# EAGLE schematic ABK-ECS - Rev B1 (EAGLE 7.7.0)

## Sheet 1 of 8: MCU
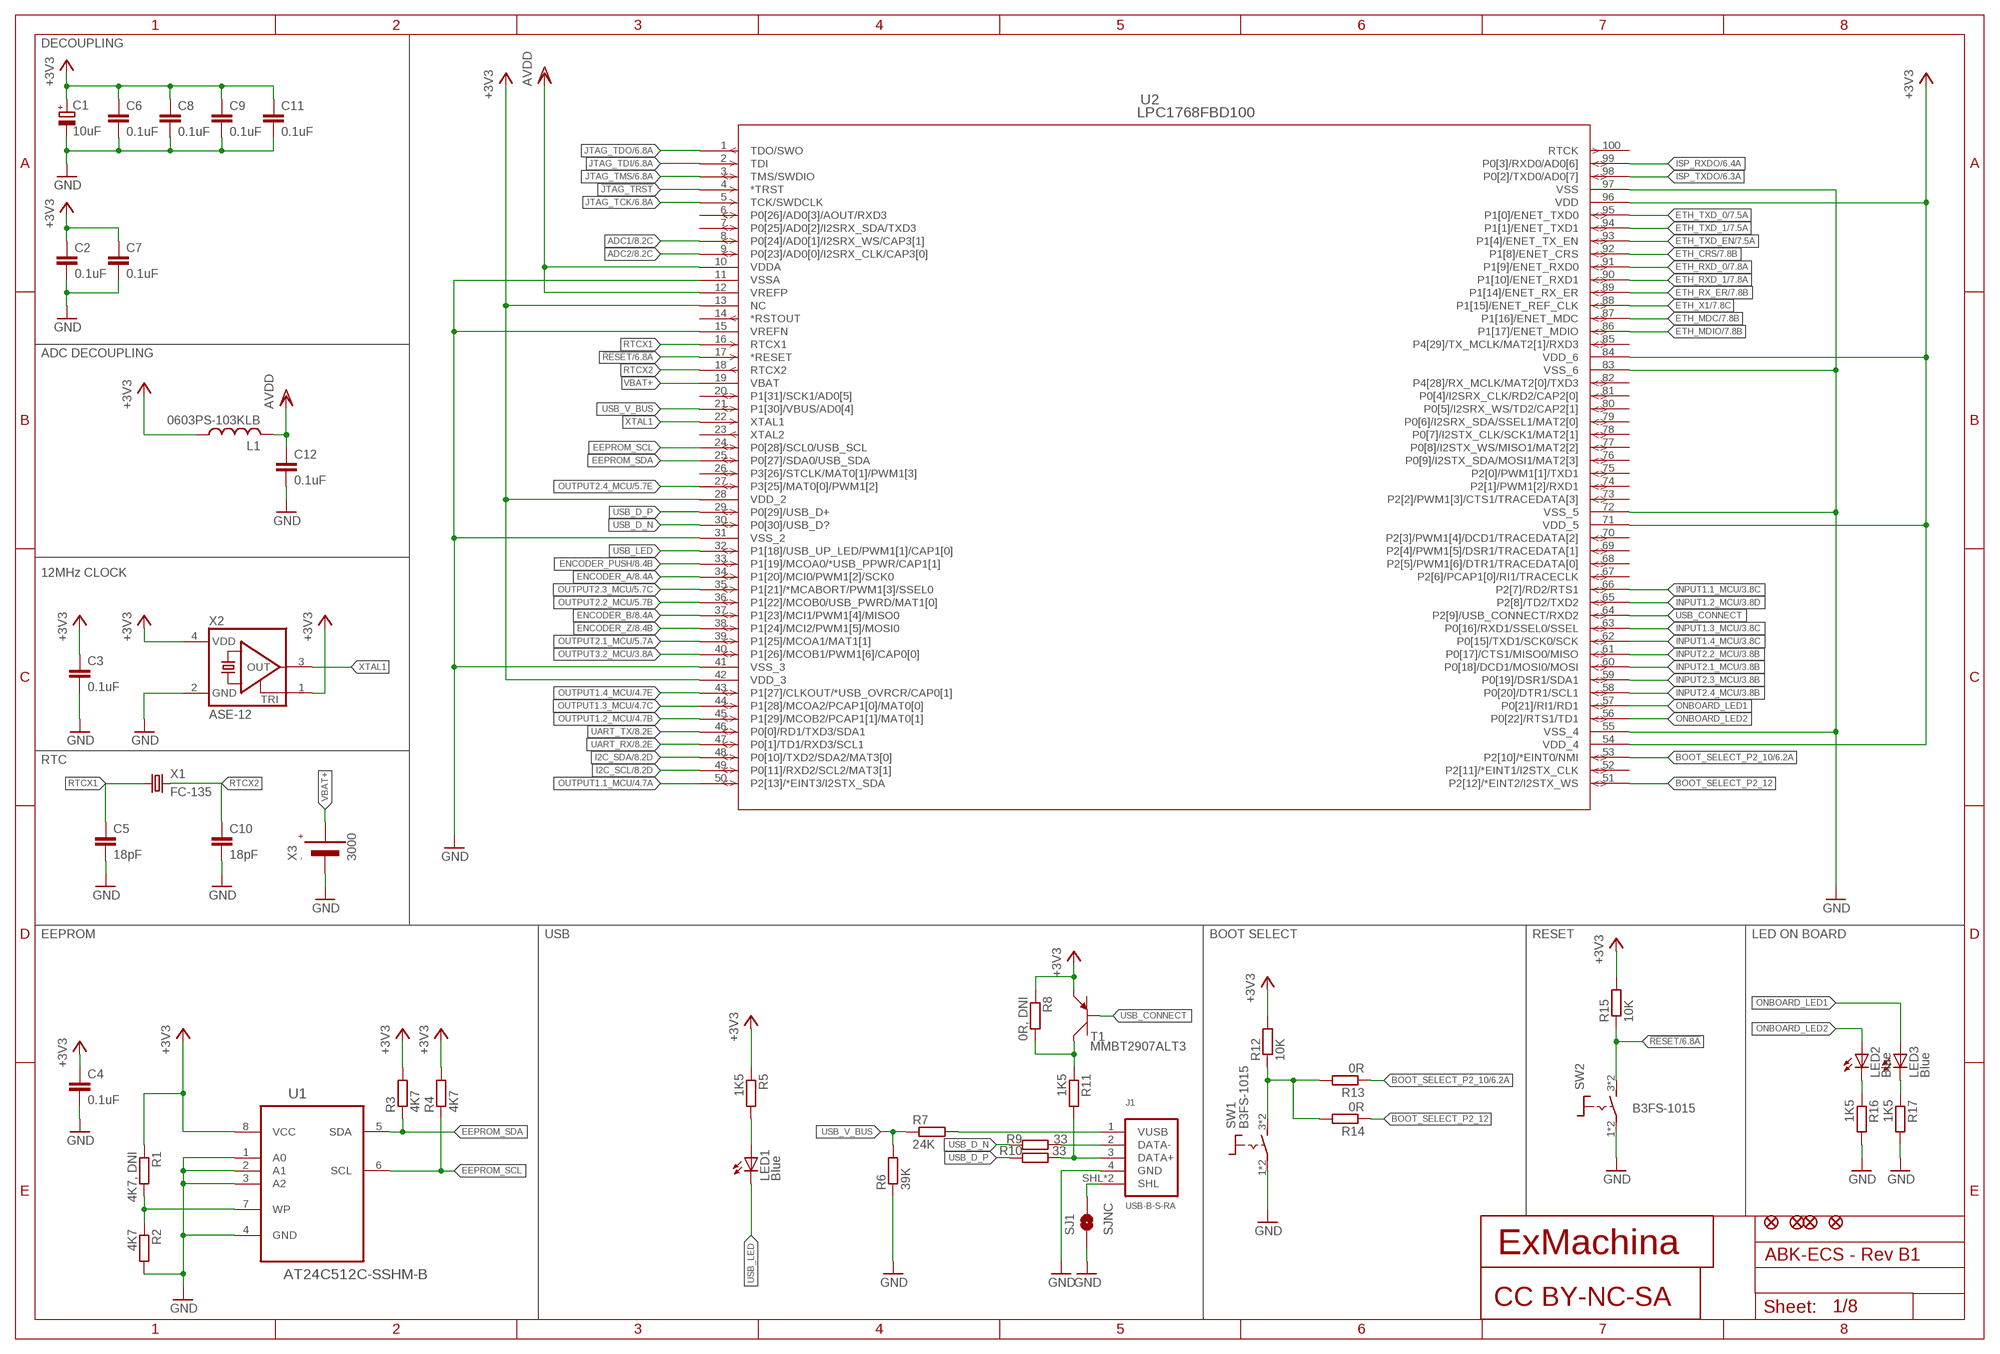
[diagram p0: schematic, sheet 1]

### Parts
C1  10uF  CPOL-EUCT3216  [CT3216]
C2  0.1uF  C-EUC0603  [C0603]
C3  0.1uF  C-EUC0603  [C0603]
C4  0.1uF  C-EUC0603  [C0603]
C5  18pF  C-EUC0603  [C0603]
C6  0.1uF  C-EUC0603  [C0603]
C7  0.1uF  C-EUC0603  [C0603]
C8  0.1uF  C-EUC0603  [C0603]
C9  0.1uF  C-EUC0603  [C0603]
C10  18pF  C-EUC0603  [C0603]
C11  0.1uF  C-EUC0603  [C0603]
C12  0.1uF  C-EUC0603  [C0603]
CC1  CC-BY-NC-SA  [CC-BY-NC-SA]
J1  USB-B-S-RA  [USB-B-S-RA]
JP1  FIDUCIAL1X2  [FIDUCIAL-1X2]
JP2  FIDUCIAL1X2  [FIDUCIAL-1X2]
JP3  FIDUCIAL1X2  [FIDUCIAL-1X2]
JP4  FIDUCIAL1X2  [FIDUCIAL-1X2]
L1  0603PS-103KLB  0603PS  [0603]
LED1  Blue  LEDCHIPLED_0603  [CHIPLED_0603]
LED2  Blue  LEDCHIPLED_0603  [CHIPLED_0603]
LED3  Blue  LEDCHIPLED_0603  [CHIPLED_0603]
R1  4K7, DNI  R-EU_R0603  [R0603]
R2  4K7  R-EU_R0603  [R0603]
R3  4K7  R-EU_R0603  [R0603]
R4  4K7  R-EU_R0603  [R0603]
R5  1K5  R-EU_R0603  [R0603]
R6  39K  R-EU_R0603  [R0603]
R7  24K  R-EU_R0603  [R0603]
R8  0R, DNI  R-EU_R0603  [R0603]
R9  33  R-EU_R0603  [R0603]
R10  33  R-EU_R0603  [R0603]
R11  1K5  R-EU_R0603  [R0603]
R12  10K  R-EU_R0603  [R0603]
R13  0R  R-EU_R0603  [R0603]
R14  0R  R-EU_R0603  [R0603]
R15  10K  R-EU_R0603  [R0603]
R16  1K5  R-EU_R0603  [R0603]
R17  1K5  R-EU_R0603  [R0603]
SJ1  SJNC  [SJ_2S]
SW1  B3FS-1015  [B3FS]
SW2  B3FS-1015  [B3FS]
T1  MMBT2907ALT3  [SOT−23]
T2  EXMACHINA-LOGO-NAME  [EXM-LOGO-BASELINE]
U1  AT24C512C-SSHM-B  [SOIC127P600X175-8N]
U2  LPC1768FBD100  [SOT407-1]
X1  FC-135  [FC-135]
X2  ASE-12  ASE  [ASE]
X3  3000  [3000]

### Nets
!JTAG_TRST: U2.4(*TRST)
!RESET: R15.1 SW2.3 SW2.4 U2.17(*RESET) ; also sheet 6
+3V3 [supply]: C1.+ C2.1 C3.1 C4.1 C6.1 C7.1 C8.1 C9.1 C11.1 L1.P$1 R1.1 R3.2 R4.2 R5.1 R8.1 R12.2 R15.2 T1.3(C) U1.8(VCC) U2.13(NC) U2.28(VDD_2) U2.42(VDD_3) U2.54(VDD_4) U2.71(VDD_5) U2.84(VDD_6) U2.96(VDD) X2.1(TRI) X2.4(VDD) ; also sheet 2,3,6,7,8
ADC1: U2.8(P0[24]/AD0[1]/I2SRX_WS/CAP3[1]) ; also sheet 8
ADC2: U2.9(P0[23]/AD0[0]/I2SRX_CLK/CAP3[0]) ; also sheet 8
AVDD: C12.1 L1.P$2 U2.10(VDDA) U2.12(VREFP) ; also sheet 8
BOOT_SELECT_P2_10 [signal]: R13.1 U2.53(P2[10]/*EINT0/NMI) ; also sheet 6
BOOT_SELECT_P2_12 [signal]: R14.1 U2.51(P2[12]/*EINT2/I2STX_WS)
EEPROM_SCL: R4.1 U1.6(SCL) U2.24(P0[28]/SCL0/USB_SCL)
EEPROM_SDA: R3.1 U1.5(SDA) U2.25(P0[27]/SDA0/USB_SDA)
ENCODER_A: U2.34(P1[20]/MCI0/PWM1[2]/SCK0) ; also sheet 8
ENCODER_B: U2.37(P1[23]/MCI1/PWM1[4]/MISO0) ; also sheet 8
ENCODER_PUSH: U2.33(P1[19]/MCOA0/*USB_PPWR/CAP1[1]) ; also sheet 8
ENCODER_Z: U2.38(P1[24]/MCI2/PWM1[5]/MOSI0) ; also sheet 8
ETH_CRS [signal]: U2.92(P1[8]/ENET_CRS) ; also sheet 7
ETH_MDC [signal]: U2.87(P1[16]/ENET_MDC) ; also sheet 7
ETH_MDIO [signal]: U2.86(P1[17]/ENET_MDIO) ; also sheet 7
ETH_RX_ER [signal]: U2.89(P1[14]/ENET_RX_ER) ; also sheet 7
ETH_RXD_0 [signal]: U2.91(P1[9]/ENET_RXD0) ; also sheet 7
ETH_RXD_1 [signal]: U2.90(P1[10]/ENET_RXD1) ; also sheet 7
ETH_TXD_0 [signal]: U2.95(P1[0]/ENET_TXD0) ; also sheet 7
ETH_TXD_1 [signal]: U2.94(P1[1]/ENET_TXD1) ; also sheet 7
ETH_TXD_EN [signal]: U2.93(P1[4]/ENET_TX_EN) ; also sheet 7
ETH_X1 [signal]: U2.88(P1[15]/ENET_REF_CLK) ; also sheet 7
GND [supply]: C1.- C2.2 C3.2 C4.2 C5.2 C6.2 C7.2 C8.2 C9.2 C10.2 C11.2 C12.2 J1.4(GND) R2.2 R6.1 R16.2 R17.2 SJ1.1 SW1.1 SW1.2 SW2.1 SW2.2 U1.1(A0) U1.2(A1) U1.3(A2) U1.4(GND) U2.11(VSSA) U2.15(VREFN) U2.31(VSS_2) U2.41(VSS_3) U2.55(VSS_4) U2.72(VSS_5) U2.83(VSS_6) U2.97(VSS) X2.2(GND) X3.-(VBAT-) ; also sheet 2,3,4,5,6,7,8
I2C_SCL: U2.49(P0[11]/RXD2/SCL2/MAT3[1]) ; also sheet 8
I2C_SDA: U2.48(P0[10]/TXD2/SDA2/MAT3[0]) ; also sheet 8
INPUT1.1_MCU: U2.66(P2[7]/RD2/RTS1) ; also sheet 3
INPUT1.2_MCU: U2.65(P2[8]/TD2/TXD2) ; also sheet 3
INPUT1.3_MCU: U2.63(P0[16]/RXD1/SSEL0/SSEL) ; also sheet 3
INPUT1.4_MCU: U2.62(P0[15]/TXD1/SCK0/SCK) ; also sheet 3
INPUT2.1_MCU: U2.60(P0[18]/DCD1/MOSI0/MOSI) ; also sheet 3
INPUT2.2_MCU: U2.61(P0[17]/CTS1/MISO0/MISO) ; also sheet 3
INPUT2.3_MCU: U2.59(P0[19]/DSR1/SDA1) ; also sheet 3
INPUT2.4_MCU: U2.58(P0[20]/DTR1/SCL1) ; also sheet 3
ISP_RXDO [signal]: U2.99(P0[3]/RXD0/AD0[6]) ; also sheet 6
ISP_TXDO [signal]: U2.98(P0[2]/TXD0/AD0[7]) ; also sheet 6
JTAG_TCK [signal]: U2.5(TCK/SWDCLK) ; also sheet 6
JTAG_TDI [signal]: U2.2(TDI) ; also sheet 6
JTAG_TDO [signal]: U2.1(TDO/SWO) ; also sheet 6
JTAG_TMS [signal]: U2.3(TMS/SWDIO) ; also sheet 6
N$1 [signal]: J1.3(DATA+) R10.1 R11.2
N$2 [signal]: J1.2(DATA-) R9.1
N$3 [signal]: LED3.C R17.1
N$5 [signal]: R12.1 R13.2 R14.2 SW1.3 SW1.4
N$27: R1.2 R2.1 U1.7(WP)
N$28: LED1.A R5.2
N$29 [signal]: LED2.C R16.1
N$30: R8.2 R11.1 T1.2(E)
N$70: J1.SHL J1.SHL1(SHL) SJ1.2
N$114: J1.1(VUSB) R7.2
ONBOARD_LED1 [signal]: LED3.A U2.57(P0[21]/RI1/RD1)
ONBOARD_LED2 [signal]: LED2.A U2.56(P0[22]/RTS1/TD1)
OUTPUT1.1_MCU: U2.50(P2[13]/*EINT3/I2STX_SDA) ; also sheet 4
OUTPUT1.2_MCU: U2.45(P1[29]/MCOB2/PCAP1[1]/MAT0[1]) ; also sheet 4
OUTPUT1.3_MCU: U2.44(P1[28]/MCOA2/PCAP1[0]/MAT0[0]) ; also sheet 4
OUTPUT1.4_MCU: U2.43(P1[27]/CLKOUT/*USB_OVRCR/CAP0[1]) ; also sheet 4
OUTPUT2.1_MCU: U2.39(P1[25]/MCOA1/MAT1[1]) ; also sheet 5
OUTPUT2.2_MCU: U2.36(P1[22]/MCOB0/USB_PWRD/MAT1[0]) ; also sheet 5
OUTPUT2.3_MCU: U2.35(P1[21]/*MCABORT/PWM1[3]/SSEL0) ; also sheet 5
OUTPUT2.4_MCU: U2.27(P3[25]/MAT0[0]/PWM1[2]) ; also sheet 5
OUTPUT3.2_MCU: U2.40(P1[26]/MCOB1/PWM1[6]/CAP0[0]) ; also sheet 3,5
RTCX1: C5.1 U2.16(RTCX1) X1.1
RTCX2: C10.1 U2.18(RTCX2) X1.2
UART_RX: U2.47(P0[1]/TD1/RXD3/SCL1) ; also sheet 8
UART_TX: U2.46(P0[0]/RD1/TXD3/SDA1) ; also sheet 8
USB_CONNECT: T1.1(B) U2.64(P2[9]/USB_CONNECT/RXD2)
USB_D_N [signal]: R9.2 U2.30(P0[30]/USB_D?)
USB_D_P [signal]: R10.2 U2.29(P0[29]/USB_D+)
USB_LED: LED1.C U2.32(P1[18]/USB_UP_LED/PWM1[1]/CAP1[0])
USB_V_BUS [signal]: R6.2 R7.1 U2.21(P1[30]/VBUS/AD0[4])
VBAT+: U2.19(VBAT) X3.+1(VBAT+) X3.+2(VBAT+)
XTAL1: U2.22(XTAL1) X2.3(OUT)
Unconnected: U2.6(P0[26]/AD0[3]/AOUT/RXD3) U2.7(P0[25]/AD0[2]/I2SRX_SDA/TXD3) U2.14(*RSTOUT) U2.20(P1[31]/SCK1/AD0[5]) U2.23(XTAL2) U2.26(P3[26]/STCLK/MAT0[1]/PWM1[3]) U2.52(P2[11]/*EINT1/I2STX_CLK) U2.67(P2[6]/PCAP1[0]/RI1/TRACECLK) U2.68(P2[5]/PWM1[6]/DTR1/TRACEDATA[0]) U2.69(P2[4]/PWM1[5]/DSR1/TRACEDATA[1]) U2.70(P2[3]/PWM1[4]/DCD1/TRACEDATA[2]) U2.73(P2[2]/PWM1[3]/CTS1/TRACEDATA[3]) U2.74(P2[1]/PWM1[2]/RXD1) U2.75(P2[0]/PWM1[1]/TXD1) U2.76(P0[9]/I2STX_SDA/MOSI1/MAT2[3]) U2.77(P0[8]/I2STX_WS/MISO1/MAT2[2]) U2.78(P0[7]/I2STX_CLK/SCK1/MAT2[1]) U2.79(P0[6]/I2SRX_SDA/SSEL1/MAT2[0]) U2.80(P0[5]/I2SRX_WS/TD2/CAP2[1]) U2.81(P0[4]/I2SRX_CLK/RD2/CAP2[0]) U2.82(P4[28]/RX_MCLK/MAT2[0]/TXD3) U2.85(P4[29]/TX_MCLK/MAT2[1]/RXD3) U2.100(RTCK)

### Notes on the sheet
- DECOUPLING
- ADC DECOUPLING
- 12MHz CLOCK
- RTC
- EEPROM | USB | BOOT SELECT | RESET | LED ON BOARD

## Sheet 2 of 8: POWER
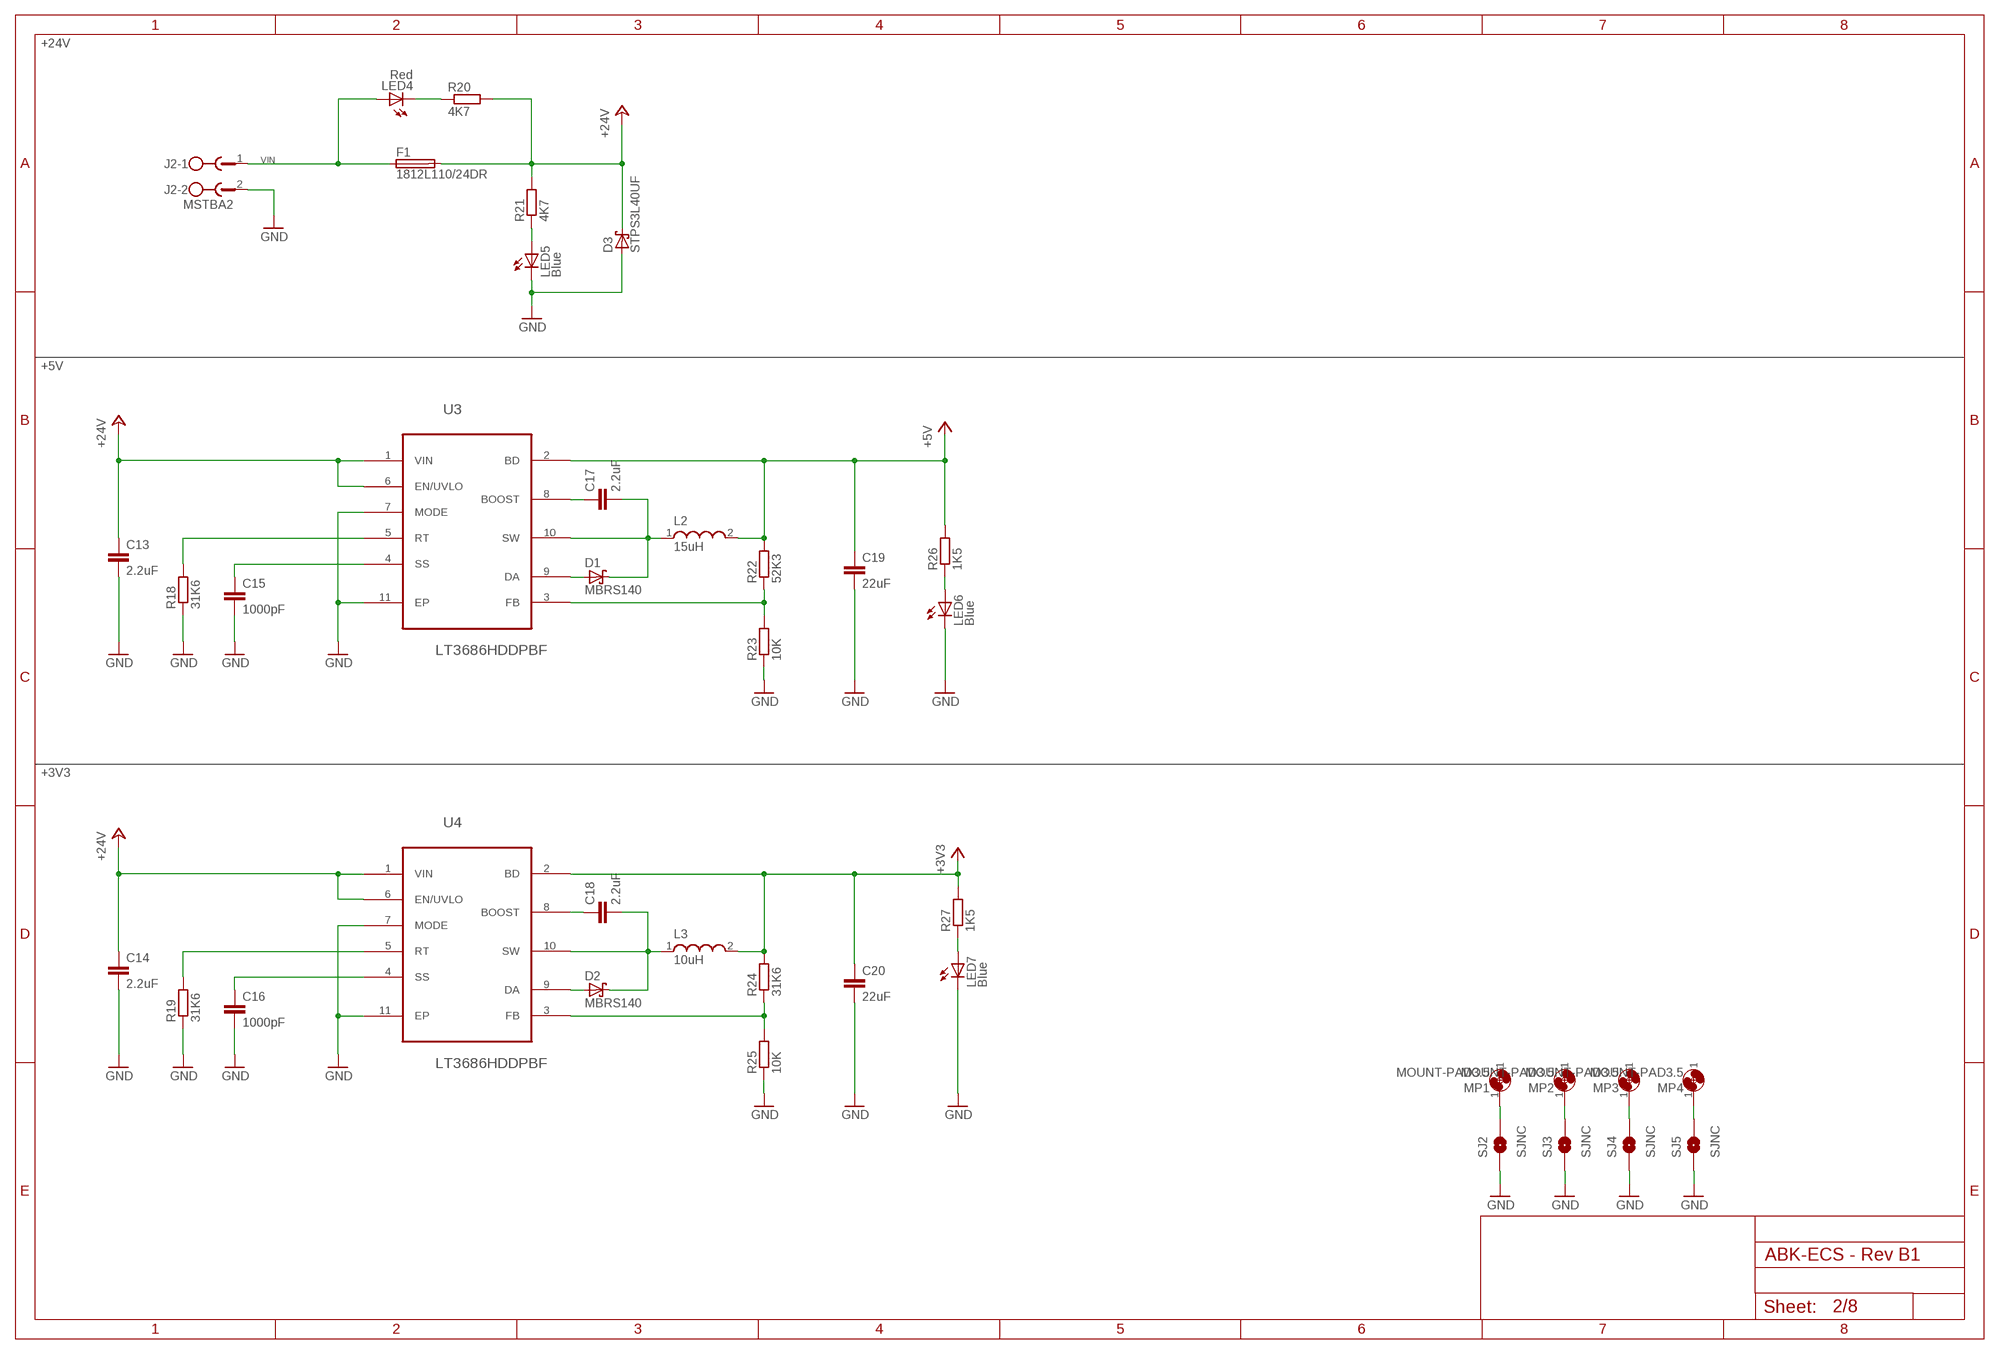
[diagram p1: schematic, sheet 2]

### Parts
C13  2.2uF  C-EUC0603  [C0603]
C14  2.2uF  C-EUC0603  [C0603]
C15  1000pF  C-EUC0603  [C0603]
C16  1000pF  C-EUC0603  [C0603]
C17  2.2uF  C-EUC0603  [C0603]
C18  2.2uF  C-EUC0603  [C0603]
C19  22uF  C-EUC0805  [C0805]
C20  22uF  C-EUC0805  [C0805]
D1  MBRS140  [DO-214AA]
D2  MBRS140  [DO-214AA]
D3  STPS3L40UF  [SMB]
F1  1812L110/24DR  [LITTLEFUSE_SMD]
J2  MSTBA2  [MSTBA2]
L2  15uH  WE-PD2_5848/5820  [WE-PD2_5848/5820]
L3  10uH  WE-PD2_5848/5820  [WE-PD2_5848/5820]
LED4  Red  LEDCHIPLED_0603  [CHIPLED_0603]
LED5  Blue  LEDCHIPLED_0603  [CHIPLED_0603]
LED6  Blue  LEDCHIPLED_0603  [CHIPLED_0603]
LED7  Blue  LEDCHIPLED_0603  [CHIPLED_0603]
MP1  MOUNT-PAD3.5  [P3,5]
MP2  MOUNT-PAD3.5  [P3,5]
MP3  MOUNT-PAD3.5  [P3,5]
MP4  MOUNT-PAD3.5  [P3,5]
R18  31K6  R-EU_R0603  [R0603]
R19  31K6  R-EU_R0603  [R0603]
R20  4K7  R-EU_R0603  [R0603]
R21  4K7  R-EU_R0603  [R0603]
R22  52K3  R-EU_R0603  [R0603]
R23  10K  R-EU_R0603  [R0603]
R24  31K6  R-EU_R0603  [R0603]
R25  10K  R-EU_R0603  [R0603]
R26  1K5  R-EU_R0603  [R0603]
R27  1K5  R-EU_R0603  [R0603]
SJ2  SJNC  [SJ_2S]
SJ3  SJNC  [SJ_2S]
SJ4  SJNC  [SJ_2S]
SJ5  SJNC  [SJ_2S]
U3  LT3686HDDPBF  [DFN300X300X80-11N]
U4  LT3686HDDPBF  [DFN300X300X80-11N]

### Nets
1: MP1.1 SJ2.2
2: MP2.1 SJ3.2
3: MP3.1 SJ4.2
4: MP4.1 SJ5.2
+3V3 [supply]: C20.1 L3.2 R24.2 R27.2 U4.2(BD) ; also sheet 1,3,6,7,8
+5V [supply]: C19.1 L2.2 R22.2 R26.2 U3.2(BD) ; also sheet 3,4,5,7,8
+24V: C13.1 C14.1 D3.C F1.2 R20.2 R21.2 U3.1(VIN) U3.6(EN/UVLO) U4.1(VIN) U4.6(EN/UVLO) ; also sheet 3,4,5
GND [supply]: C13.2 C14.2 C15.2 C16.2 C19.2 C20.2 D3.A J2.2 LED5.C LED6.C LED7.C R18.1 R19.1 R23.1 R25.1 SJ2.1 SJ3.1 SJ4.1 SJ5.1 U3.7(MODE) U3.11(EP) U4.7(MODE) U4.11(EP) ; also sheet 1,3,4,5,6,7,8
N$4: R18.2 U3.5(RT)
N$6: C15.1 U3.4(SS)
N$7: R19.2 U4.5(RT)
N$8: C16.1 U4.4(SS)
N$9: R22.1 R23.2 U3.3(FB)
N$10: C17.1 U3.8(BOOST)
N$11: C17.2 D1.C L2.1 U3.10(SW)
N$12: D1.A U3.9(DA)
N$13: R24.1 R25.2 U4.3(FB)
N$14: C18.1 U4.8(BOOST)
N$15: C18.2 D2.C L3.1 U4.10(SW)
N$16: D2.A U4.9(DA)
N$44: LED5.A R21.1
N$45: LED4.C R20.1
N$50: LED7.A R27.1
N$51: LED6.A R26.1
VIN: F1.1 J2.1 LED4.A

### Notes on the sheet
- +24V
- +5V
- +3V3

## Sheet 3 of 8: INPUT
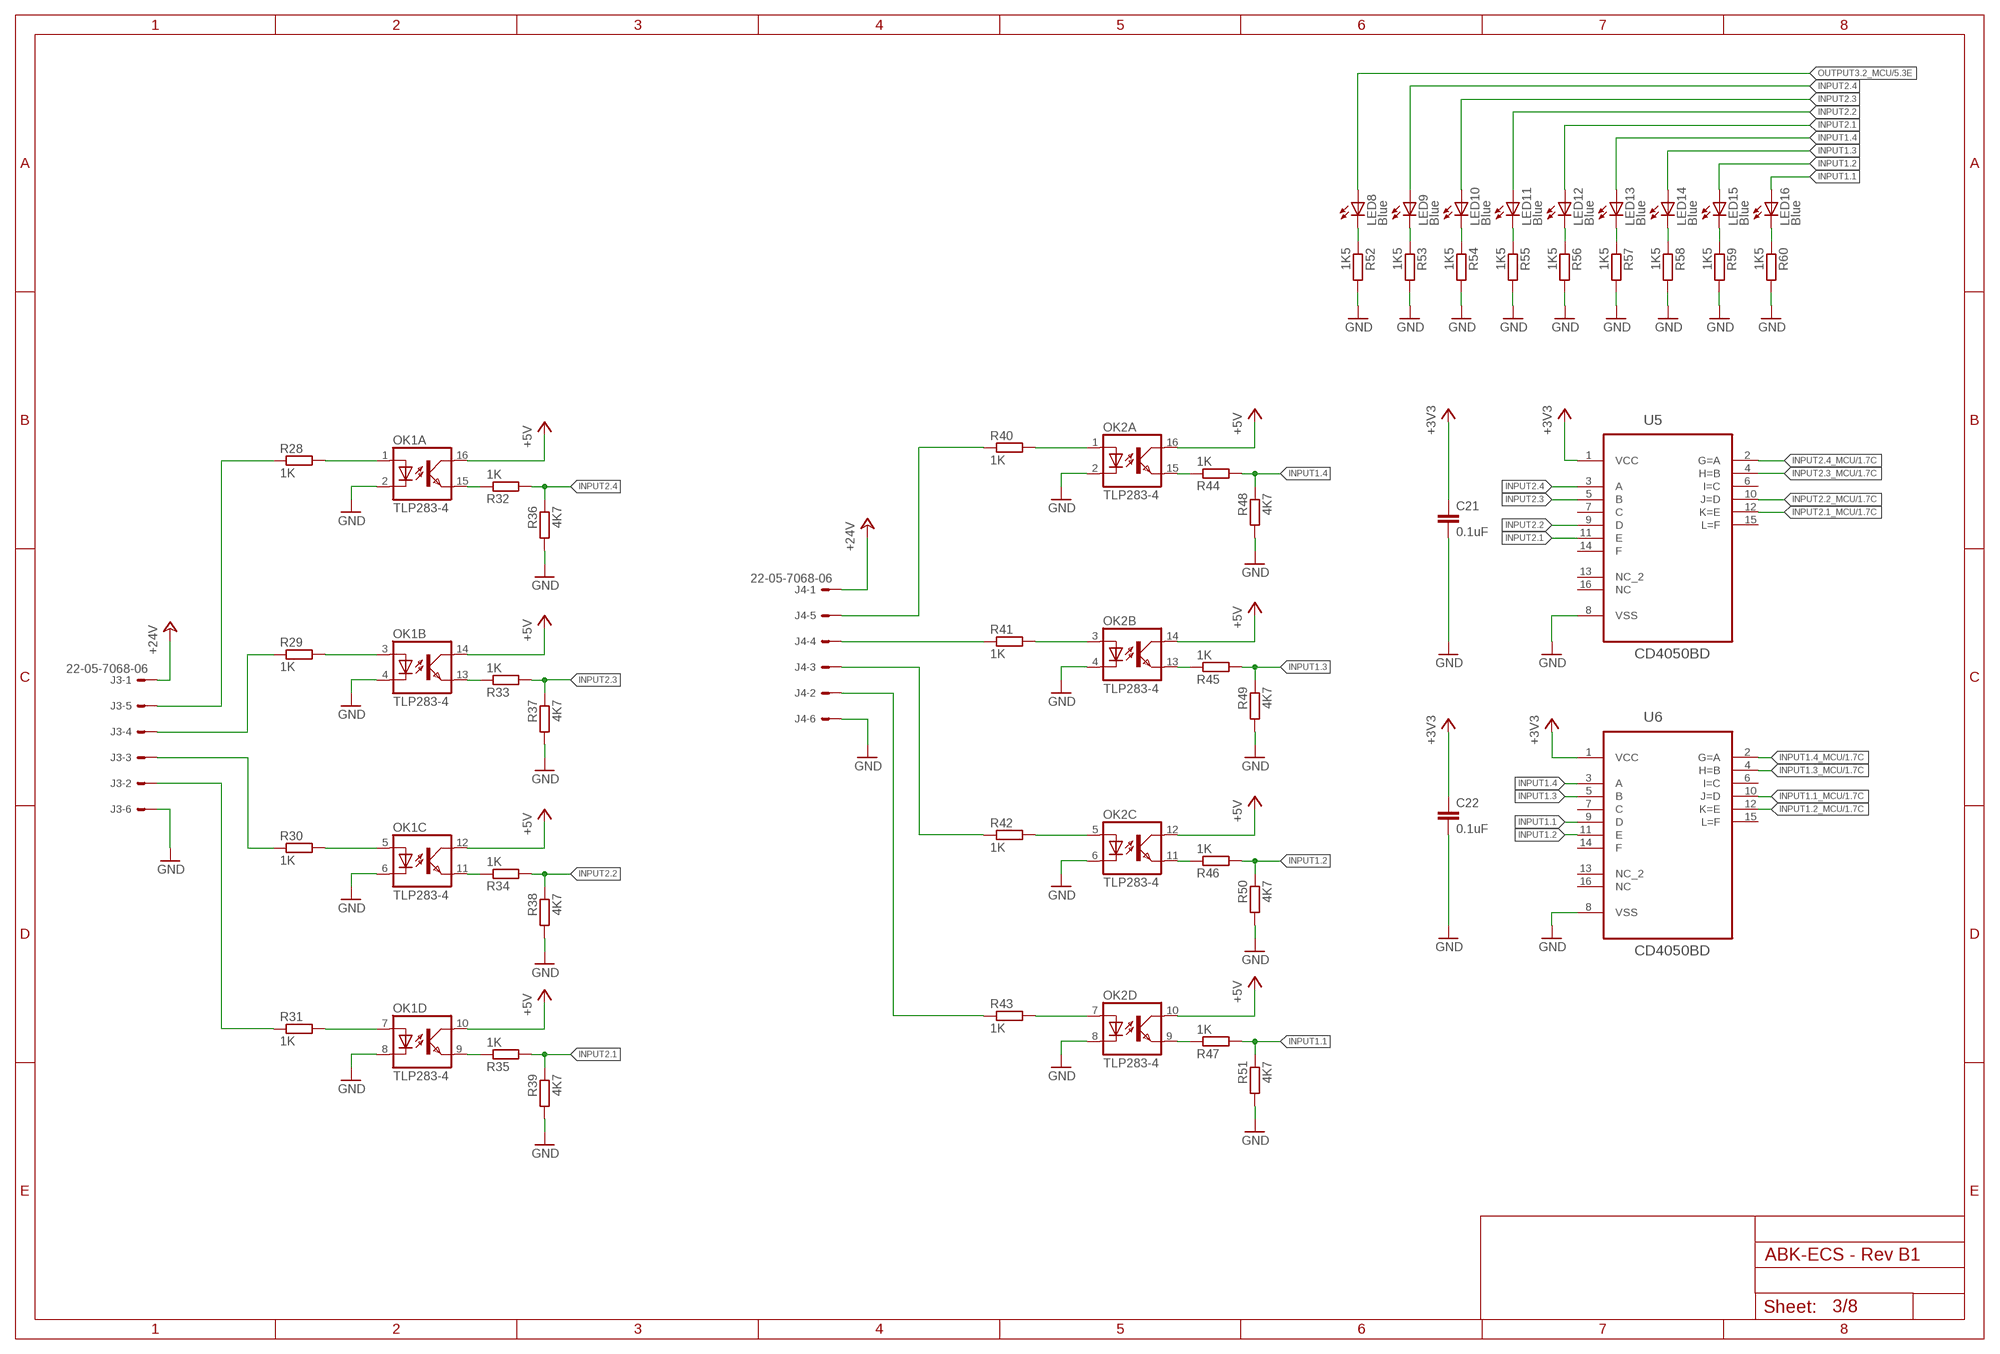
[diagram p2: schematic, sheet 3]

### Parts
C21  0.1uF  C-EUC0603  [C0603]
C22  0.1uF  C-EUC0603  [C0603]
J3  22-05-7068-06  [7395-06]
J4  22-05-7068-06  [7395-06]
LED8  Blue  LEDCHIPLED_0603  [CHIPLED_0603]
LED9  Blue  LEDCHIPLED_0603  [CHIPLED_0603]
LED10  Blue  LEDCHIPLED_0603  [CHIPLED_0603]
LED11  Blue  LEDCHIPLED_0603  [CHIPLED_0603]
LED12  Blue  LEDCHIPLED_0603  [CHIPLED_0603]
LED13  Blue  LEDCHIPLED_0603  [CHIPLED_0603]
LED14  Blue  LEDCHIPLED_0603  [CHIPLED_0603]
LED15  Blue  LEDCHIPLED_0603  [CHIPLED_0603]
LED16  Blue  LEDCHIPLED_0603  [CHIPLED_0603]
OK1  TLP283-4  [MINI-FLAT-16]
OK2  TLP283-4  [MINI-FLAT-16]
R28  1K  R-EU_R0603  [R0603]
R29  1K  R-EU_R0603  [R0603]
R30  1K  R-EU_R0603  [R0603]
R31  1K  R-EU_R0603  [R0603]
R32  1K  R-EU_R0603  [R0603]
R33  1K  R-EU_R0603  [R0603]
R34  1K  R-EU_R0603  [R0603]
R35  1K  R-EU_R0603  [R0603]
R36  4K7  R-EU_R0603  [R0603]
R37  4K7  R-EU_R0603  [R0603]
R38  4K7  R-EU_R0603  [R0603]
R39  4K7  R-EU_R0603  [R0603]
R40  1K  R-EU_R0603  [R0603]
R41  1K  R-EU_R0603  [R0603]
R42  1K  R-EU_R0603  [R0603]
R43  1K  R-EU_R0603  [R0603]
R44  1K  R-EU_R0603  [R0603]
R45  1K  R-EU_R0603  [R0603]
R46  1K  R-EU_R0603  [R0603]
R47  1K  R-EU_R0603  [R0603]
R48  4K7  R-EU_R0603  [R0603]
R49  4K7  R-EU_R0603  [R0603]
R50  4K7  R-EU_R0603  [R0603]
R51  4K7  R-EU_R0603  [R0603]
R52  1K5  R-EU_R0603  [R0603]
R53  1K5  R-EU_R0603  [R0603]
R54  1K5  R-EU_R0603  [R0603]
R55  1K5  R-EU_R0603  [R0603]
R56  1K5  R-EU_R0603  [R0603]
R57  1K5  R-EU_R0603  [R0603]
R58  1K5  R-EU_R0603  [R0603]
R59  1K5  R-EU_R0603  [R0603]
R60  1K5  R-EU_R0603  [R0603]
U5  CD4050BD  [SOIC127P600X175-16N]
U6  CD4050BD  [SOIC127P600X175-16N]

### Nets
+3V3 [supply]: C21.1 C22.1 U5.1(VCC) U6.1(VCC) ; also sheet 1,2,6,7,8
+5V [supply]: OK1.10(D:COL) OK1.12(C:COL) OK1.14(B:COL) OK1.16(A:COL) OK2.10(D:COL) OK2.12(C:COL) OK2.14(B:COL) OK2.16(A:COL) ; also sheet 2,4,5,7,8
+24V: J3.1 J4.1 ; also sheet 2,4,5
GND [supply]: C21.2 C22.2 J3.6 J4.6 OK1.2(A:C) OK1.4(B:C) OK1.6(C:C) OK1.8(D:C) OK2.2(A:C) OK2.4(B:C) OK2.6(C:C) OK2.8(D:C) R36.2 R37.2 R38.2 R39.2 R48.2 R49.2 R50.2 R51.2 R52.2 R53.2 R54.2 R55.2 R56.2 R57.2 R58.2 R59.2 R60.2 U5.8(VSS) U6.8(VSS) ; also sheet 1,2,4,5,6,7,8
INPUT1.1: LED16.A R47.2 R51.1 U6.9(D)
INPUT1.1_MCU: U6.10(J=D) ; also sheet 1
INPUT1.2: LED15.A R46.2 R50.1 U6.11(E)
INPUT1.2_MCU: U6.12(K=E) ; also sheet 1
INPUT1.3: LED14.A R45.2 R49.1 U6.5(B)
INPUT1.3_MCU: U6.4(H=B) ; also sheet 1
INPUT1.4: LED13.A R44.2 R48.1 U6.3(A)
INPUT1.4_MCU: U6.2(G=A) ; also sheet 1
INPUT2.1: LED12.A R35.2 R39.1 U5.11(E)
INPUT2.1_MCU: U5.12(K=E) ; also sheet 1
INPUT2.2: LED11.A R34.2 R38.1 U5.9(D)
INPUT2.2_MCU: U5.10(J=D) ; also sheet 1
INPUT2.3: LED10.A R33.2 R37.1 U5.5(B)
INPUT2.3_MCU: U5.4(H=B) ; also sheet 1
INPUT2.4: LED9.A R32.2 R36.1 U5.3(A)
INPUT2.4_MCU: U5.2(G=A) ; also sheet 1
N$41: OK1.1(A:A) R28.2
N$47: OK1.3(B:A) R29.2
N$48: OK1.5(C:A) R30.2
N$49: OK1.7(D:A) R31.2
N$52: J3.2 R31.1
N$53: J3.3 R30.1
N$54: J3.4 R29.1
N$55: J3.5 R28.1
N$56 [signal]: LED8.C R52.1
N$57 [signal]: LED9.C R53.1
N$58 [signal]: LED10.C R54.1
N$59 [signal]: LED11.C R55.1
N$61: OK1.9(D:EMIT) R35.1
N$62: OK1.11(C:EMIT) R34.1
N$63: OK1.13(B:EMIT) R33.1
N$64: OK1.15(A:EMIT) R32.1
N$65 [signal]: LED12.C R56.1
N$81: OK2.1(A:A) R40.2
N$82: J4.5 R40.1
N$90 [signal]: LED16.C R60.1
N$100: OK2.15(A:EMIT) R44.1
N$101: OK2.3(B:A) R41.2
N$102: J4.4 R41.1
N$103: OK2.13(B:EMIT) R45.1
N$104: OK2.5(C:A) R42.2
N$105: J4.3 R42.1
N$106: OK2.11(C:EMIT) R46.1
N$107 [signal]: LED13.C R57.1
N$108 [signal]: LED14.C R58.1
N$109 [signal]: LED15.C R59.1
N$110: OK2.9(D:EMIT) R47.1
N$111: OK2.7(D:A) R43.2
N$112: J4.2 R43.1
OUTPUT3.2_MCU: LED8.A ; also sheet 1,5
Unconnected: U5.6(I=C) U5.7(C) U5.13(NC_2) U5.14(F) U5.15(L=F) U5.16(NC) U6.6(I=C) U6.7(C) U6.13(NC_2) U6.14(F) U6.15(L=F) U6.16(NC)

## Sheet 4 of 8: OUTPUT 1/2
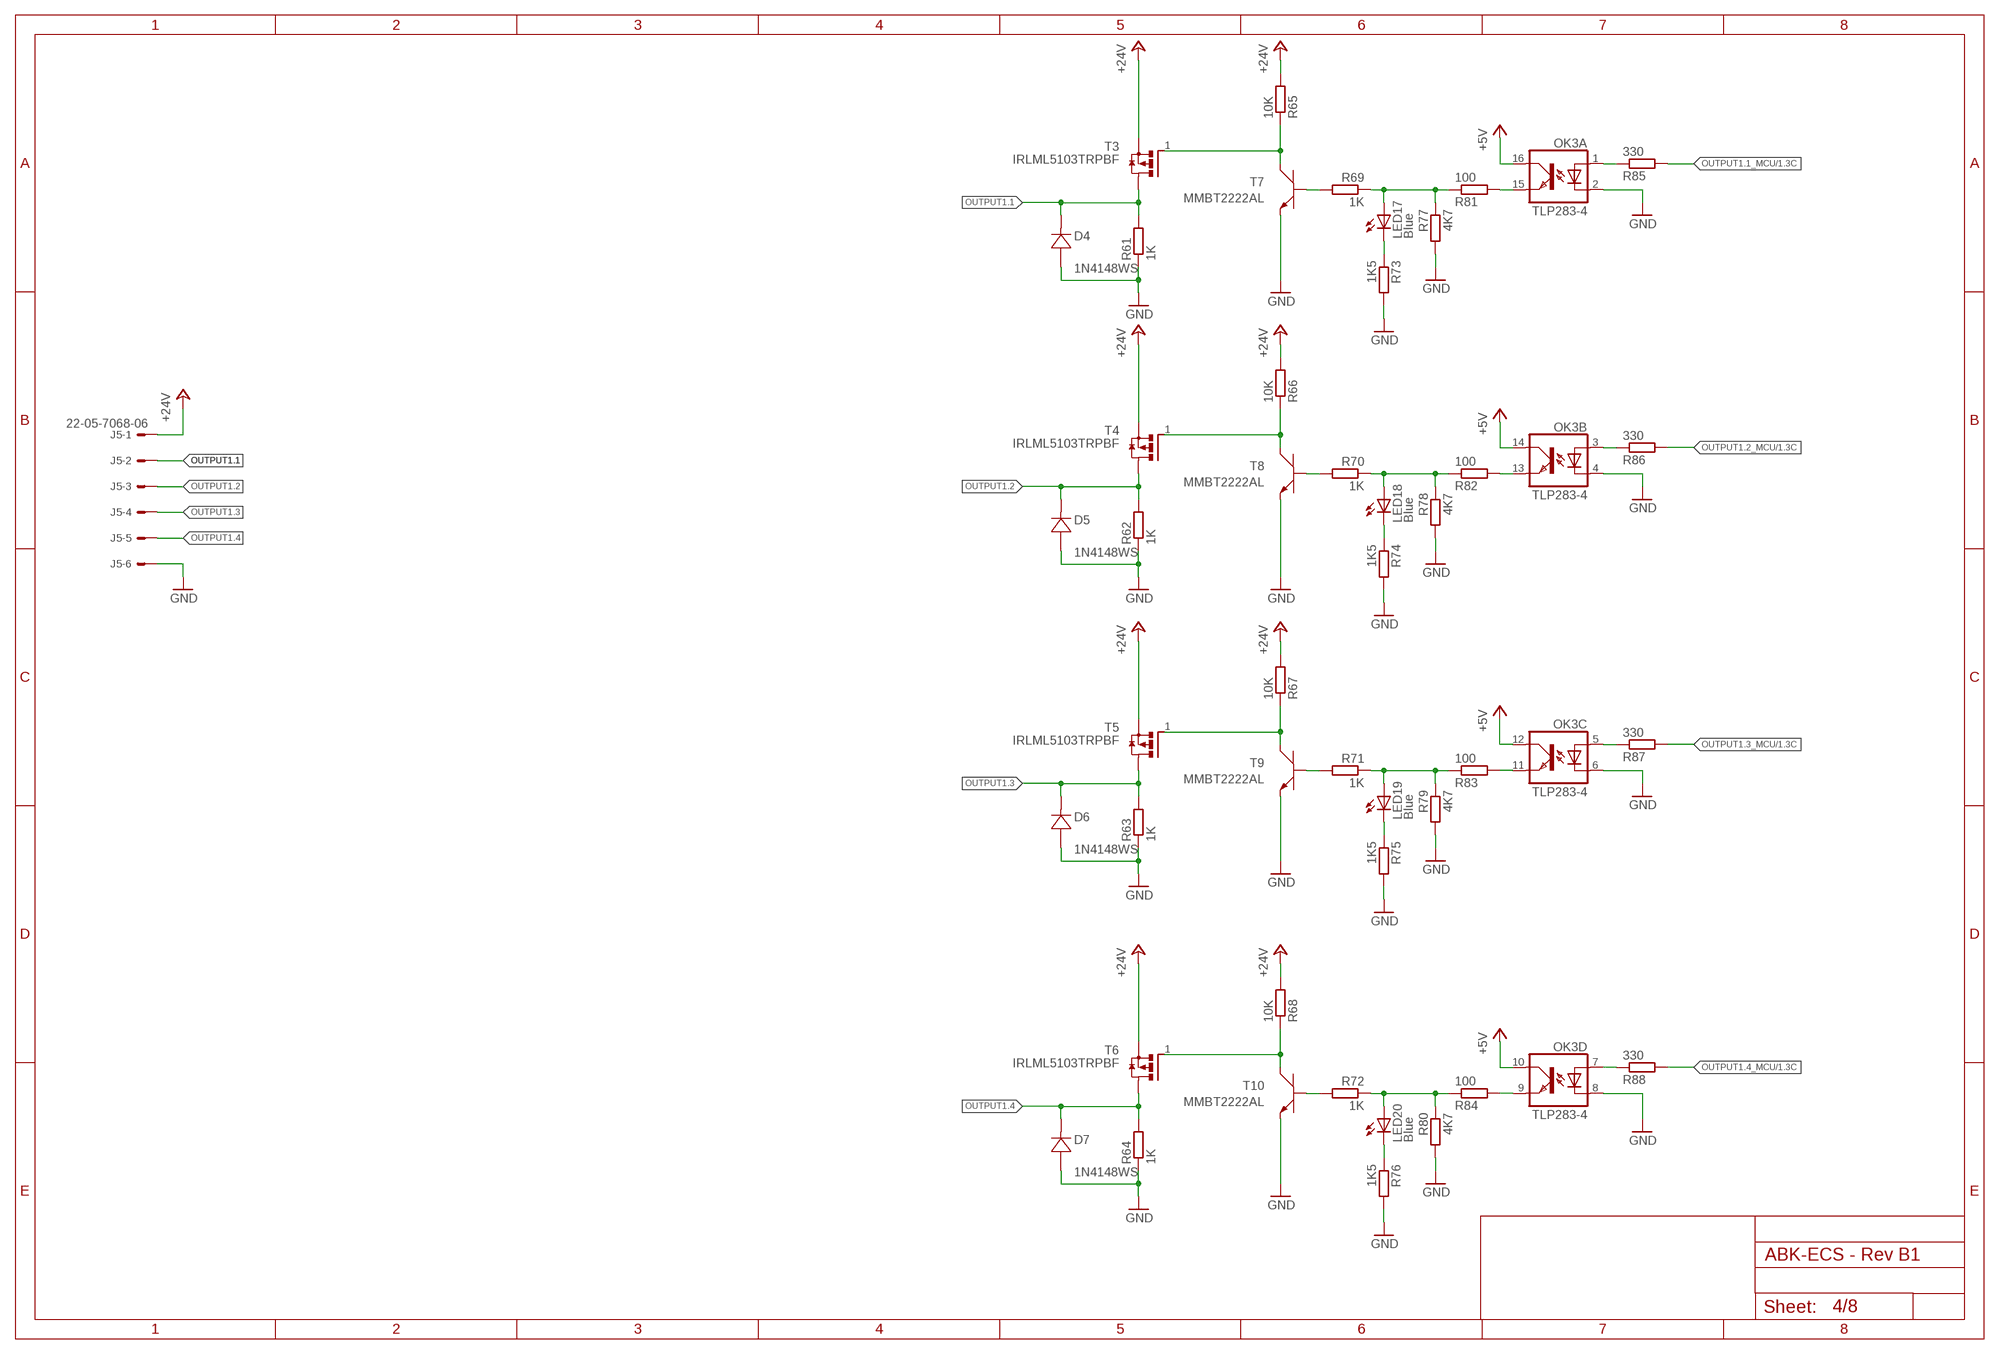
[diagram p3: schematic, sheet 4]

### Parts
D4  1N4148WS  [SOD323-W]
D5  1N4148WS  [SOD323-W]
D6  1N4148WS  [SOD323-W]
D7  1N4148WS  [SOD323-W]
J5  22-05-7068-06  [7395-06]
LED17  Blue  LEDCHIPLED_0603  [CHIPLED_0603]
LED18  Blue  LEDCHIPLED_0603  [CHIPLED_0603]
LED19  Blue  LEDCHIPLED_0603  [CHIPLED_0603]
LED20  Blue  LEDCHIPLED_0603  [CHIPLED_0603]
OK3  TLP283-4  [MINI-FLAT-16]
R61  1K  R-EU_R1206  [R1206]
R62  1K  R-EU_R1206  [R1206]
R63  1K  R-EU_R1206  [R1206]
R64  1K  R-EU_R1206  [R1206]
R65  10K  R-EU_R0603  [R0603]
R66  10K  R-EU_R0603  [R0603]
R67  10K  R-EU_R0603  [R0603]
R68  10K  R-EU_R0603  [R0603]
R69  1K  R-EU_R0603  [R0603]
R70  1K  R-EU_R0603  [R0603]
R71  1K  R-EU_R0603  [R0603]
R72  1K  R-EU_R0603  [R0603]
R73  1K5  R-EU_R0603  [R0603]
R74  1K5  R-EU_R0603  [R0603]
R75  1K5  R-EU_R0603  [R0603]
R76  1K5  R-EU_R0603  [R0603]
R77  4K7  R-EU_R0603  [R0603]
R78  4K7  R-EU_R0603  [R0603]
R79  4K7  R-EU_R0603  [R0603]
R80  4K7  R-EU_R0603  [R0603]
R81  100  R-EU_R0603  [R0603]
R82  100  R-EU_R0603  [R0603]
R83  100  R-EU_R0603  [R0603]
R84  100  R-EU_R0603  [R0603]
R85  330  R-EU_R0603  [R0603]
R86  330  R-EU_R0603  [R0603]
R87  330  R-EU_R0603  [R0603]
R88  330  R-EU_R0603  [R0603]
T3  IRLML5103TRPBF  [SOT95P240X112-3N]
T4  IRLML5103TRPBF  [SOT95P240X112-3N]
T5  IRLML5103TRPBF  [SOT95P240X112-3N]
T6  IRLML5103TRPBF  [SOT95P240X112-3N]
T7  MMBT2222AL  [SOT−23]
T8  MMBT2222AL  [SOT−23]
T9  MMBT2222AL  [SOT−23]
T10  MMBT2222AL  [SOT−23]

### Nets
+5V [supply]: OK3.10(D:COL) OK3.12(C:COL) OK3.14(B:COL) OK3.16(A:COL) ; also sheet 2,3,5,7,8
+24V: J5.1 R65.2 R66.2 R67.2 R68.2 T3.2(S) T4.2(S) T5.2(S) T6.2(S) ; also sheet 2,3,5
GND [supply]: D4.A D5.A D6.A D7.A J5.6 OK3.2(A:C) OK3.4(B:C) OK3.6(C:C) OK3.8(D:C) R61.1 R62.1 R63.1 R64.1 R73.2 R74.2 R75.2 R76.2 R77.2 R78.2 R79.2 R80.2 T7.2(E) T8.2(E) T9.2(E) T10.2(E) ; also sheet 1,2,3,5,6,7,8
N$31: LED17.A R69.1 R77.1 R81.1
N$33: OK3.15(A:EMIT) R81.2
N$34: LED18.A R70.1 R78.1 R82.1
N$35: OK3.13(B:EMIT) R82.2
N$36: LED19.A R71.1 R79.1 R83.1
N$37: LED20.A R72.1 R80.1 R84.1
N$38: OK3.11(C:EMIT) R83.2
N$39: OK3.9(D:EMIT) R84.2
N$40: OK3.1(A:A) R85.1
N$42: OK3.3(B:A) R86.1
N$43: OK3.7(D:A) R88.1
N$46: OK3.5(C:A) R87.1
N$66 [signal]: LED17.C R73.1
N$67 [signal]: LED18.C R74.1
N$68 [signal]: LED19.C R75.1
N$69 [signal]: LED20.C R76.1
N$71: R65.1 T3.1(G) T7.3(C)
N$72: R66.1 T4.1(G) T8.3(C)
N$77: R67.1 T5.1(G) T9.3(C)
N$78: R68.1 T6.1(G) T10.3(C)
N$84: R69.2 T7.1(B)
N$85: R70.2 T8.1(B)
N$98: R71.2 T9.1(B)
N$99: R72.2 T10.1(B)
OUTPUT1.1: D4.C J5.2 R61.2 T3.3(D)
OUTPUT1.1_MCU: R85.2 ; also sheet 1
OUTPUT1.2: D5.C J5.3 R62.2 T4.3(D)
OUTPUT1.2_MCU: R86.2 ; also sheet 1
OUTPUT1.3: D6.C J5.4 R63.2 T5.3(D)
OUTPUT1.3_MCU: R87.2 ; also sheet 1
OUTPUT1.4: D7.C J5.5 R64.2 T6.3(D)
OUTPUT1.4_MCU: R88.2 ; also sheet 1

## Sheet 5 of 8: OUTPUT 2/2
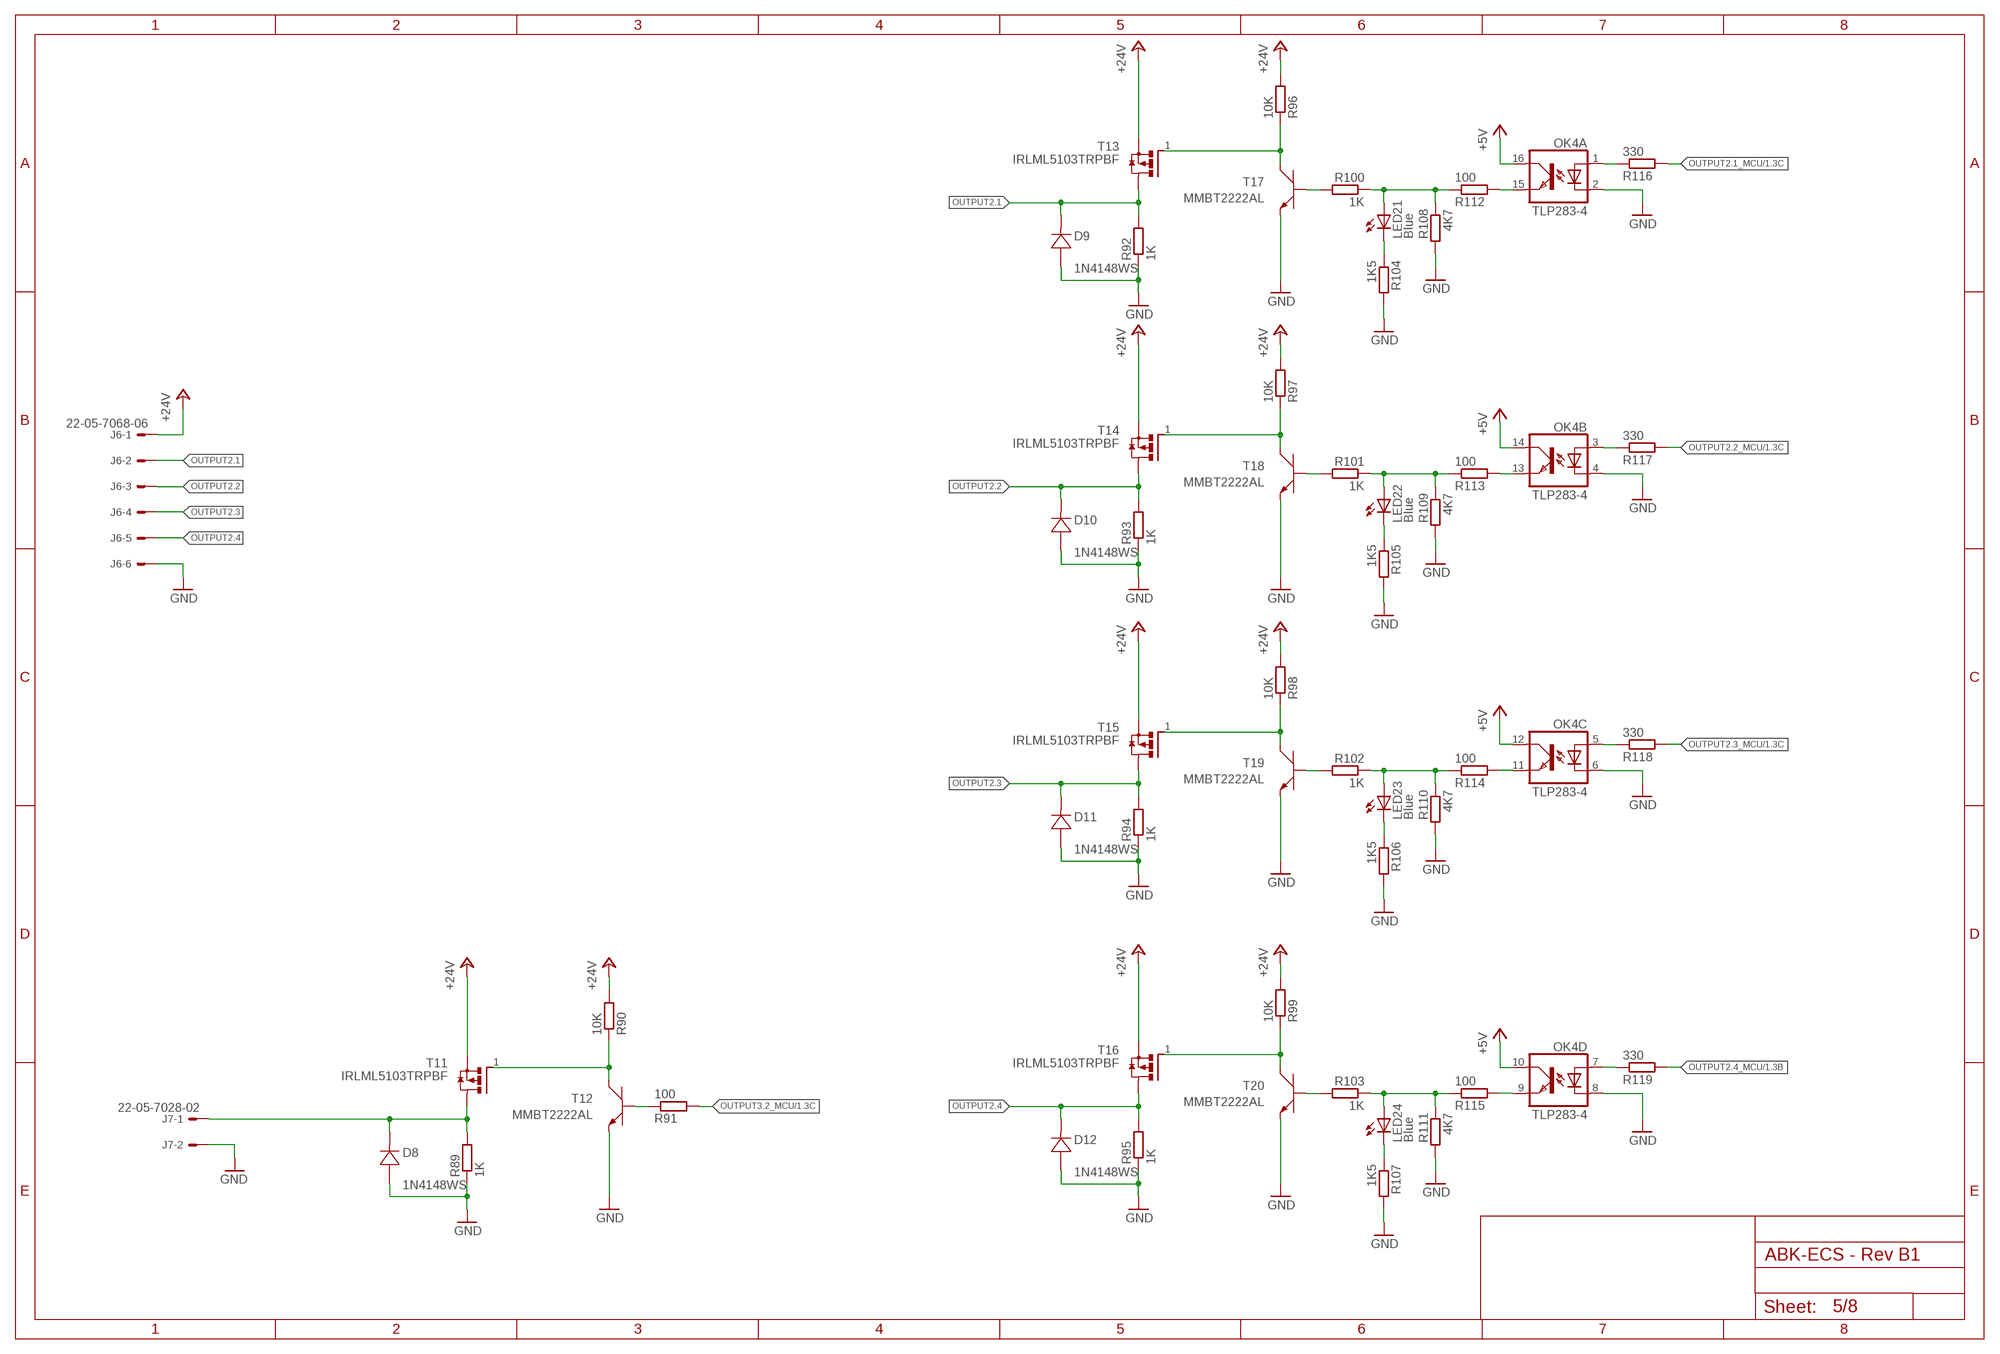
[diagram p4: schematic, sheet 5]

### Parts
D8  1N4148WS  [SOD323-W]
D9  1N4148WS  [SOD323-W]
D10  1N4148WS  [SOD323-W]
D11  1N4148WS  [SOD323-W]
D12  1N4148WS  [SOD323-W]
J6  22-05-7068-06  [7395-06]
J7  22-05-7028-02  [7395-02]
LED21  Blue  LEDCHIPLED_0603  [CHIPLED_0603]
LED22  Blue  LEDCHIPLED_0603  [CHIPLED_0603]
LED23  Blue  LEDCHIPLED_0603  [CHIPLED_0603]
LED24  Blue  LEDCHIPLED_0603  [CHIPLED_0603]
OK4  TLP283-4  [MINI-FLAT-16]
R89  1K  R-EU_R1206  [R1206]
R90  10K  R-EU_R0603  [R0603]
R91  100  R-EU_R0603  [R0603]
R92  1K  R-EU_R1206  [R1206]
R93  1K  R-EU_R1206  [R1206]
R94  1K  R-EU_R1206  [R1206]
R95  1K  R-EU_R1206  [R1206]
R96  10K  R-EU_R0603  [R0603]
R97  10K  R-EU_R0603  [R0603]
R98  10K  R-EU_R0603  [R0603]
R99  10K  R-EU_R0603  [R0603]
R100  1K  R-EU_R0603  [R0603]
R101  1K  R-EU_R0603  [R0603]
R102  1K  R-EU_R0603  [R0603]
R103  1K  R-EU_R0603  [R0603]
R104  1K5  R-EU_R0603  [R0603]
R105  1K5  R-EU_R0603  [R0603]
R106  1K5  R-EU_R0603  [R0603]
R107  1K5  R-EU_R0603  [R0603]
R108  4K7  R-EU_R0603  [R0603]
R109  4K7  R-EU_R0603  [R0603]
R110  4K7  R-EU_R0603  [R0603]
R111  4K7  R-EU_R0603  [R0603]
R112  100  R-EU_R0603  [R0603]
R113  100  R-EU_R0603  [R0603]
R114  100  R-EU_R0603  [R0603]
R115  100  R-EU_R0603  [R0603]
R116  330  R-EU_R0603  [R0603]
R117  330  R-EU_R0603  [R0603]
R118  330  R-EU_R0603  [R0603]
R119  330  R-EU_R0603  [R0603]
T11  IRLML5103TRPBF  [SOT95P240X112-3N]
T12  MMBT2222AL  [SOT−23]
T13  IRLML5103TRPBF  [SOT95P240X112-3N]
T14  IRLML5103TRPBF  [SOT95P240X112-3N]
T15  IRLML5103TRPBF  [SOT95P240X112-3N]
T16  IRLML5103TRPBF  [SOT95P240X112-3N]
T17  MMBT2222AL  [SOT−23]
T18  MMBT2222AL  [SOT−23]
T19  MMBT2222AL  [SOT−23]
T20  MMBT2222AL  [SOT−23]

### Nets
+5V [supply]: OK4.10(D:COL) OK4.12(C:COL) OK4.14(B:COL) OK4.16(A:COL) ; also sheet 2,3,4,7,8
+24V: J6.1 R90.2 R96.2 R97.2 R98.2 R99.2 T11.2(S) T13.2(S) T14.2(S) T15.2(S) T16.2(S) ; also sheet 2,3,4
GND [supply]: D8.A D9.A D10.A D11.A D12.A J6.6 J7.2 OK4.2(A:C) OK4.4(B:C) OK4.6(C:C) OK4.8(D:C) R89.1 R92.1 R93.1 R94.1 R95.1 R104.2 R105.2 R106.2 R107.2 R108.2 R109.2 R110.2 R111.2 T12.2(E) T17.2(E) T18.2(E) T19.2(E) T20.2(E) ; also sheet 1,2,3,4,6,7,8
MOTOR_VFQ: D8.C J7.1 R89.2 T11.3(D)
N$17: R100.2 T17.1(B)
N$18: R96.1 T13.1(G) T17.3(C)
N$19: R101.2 T18.1(B)
N$20: R97.1 T14.1(G) T18.3(C)
N$21: R102.2 T19.1(B)
N$22: R98.1 T15.1(G) T19.3(C)
N$23: R103.2 T20.1(B)
N$24: R99.1 T16.1(G) T20.3(C)
N$25: R91.1 T12.1(B)
N$26: R90.1 T11.1(G) T12.3(C)
N$75: LED21.A R100.1 R108.1 R112.1
N$76: OK4.15(A:EMIT) R112.2
N$79: LED22.A R101.1 R109.1 R113.1
N$80: OK4.13(B:EMIT) R113.2
N$83: LED23.A R102.1 R110.1 R114.1
N$86: LED24.A R103.1 R111.1 R115.1
N$87: OK4.11(C:EMIT) R114.2
N$88: OK4.9(D:EMIT) R115.2
N$89: OK4.1(A:A) R116.1
N$91: OK4.3(B:A) R117.1
N$92: OK4.7(D:A) R119.1
N$93: OK4.5(C:A) R118.1
N$94 [signal]: LED21.C R104.1
N$95 [signal]: LED22.C R105.1
N$96 [signal]: LED23.C R106.1
N$97 [signal]: LED24.C R107.1
OUTPUT2.1: D9.C J6.2 R92.2 T13.3(D)
OUTPUT2.1_MCU: R116.2 ; also sheet 1
OUTPUT2.2: D10.C J6.3 R93.2 T14.3(D)
OUTPUT2.2_MCU: R117.2 ; also sheet 1
OUTPUT2.3: D11.C J6.4 R94.2 T15.3(D)
OUTPUT2.3_MCU: R118.2 ; also sheet 1
OUTPUT2.4: D12.C J6.5 R95.2 T16.3(D)
OUTPUT2.4_MCU: R119.2 ; also sheet 1
OUTPUT3.2_MCU: R91.2 ; also sheet 1,3

## Sheet 6 of 8: Programming interface
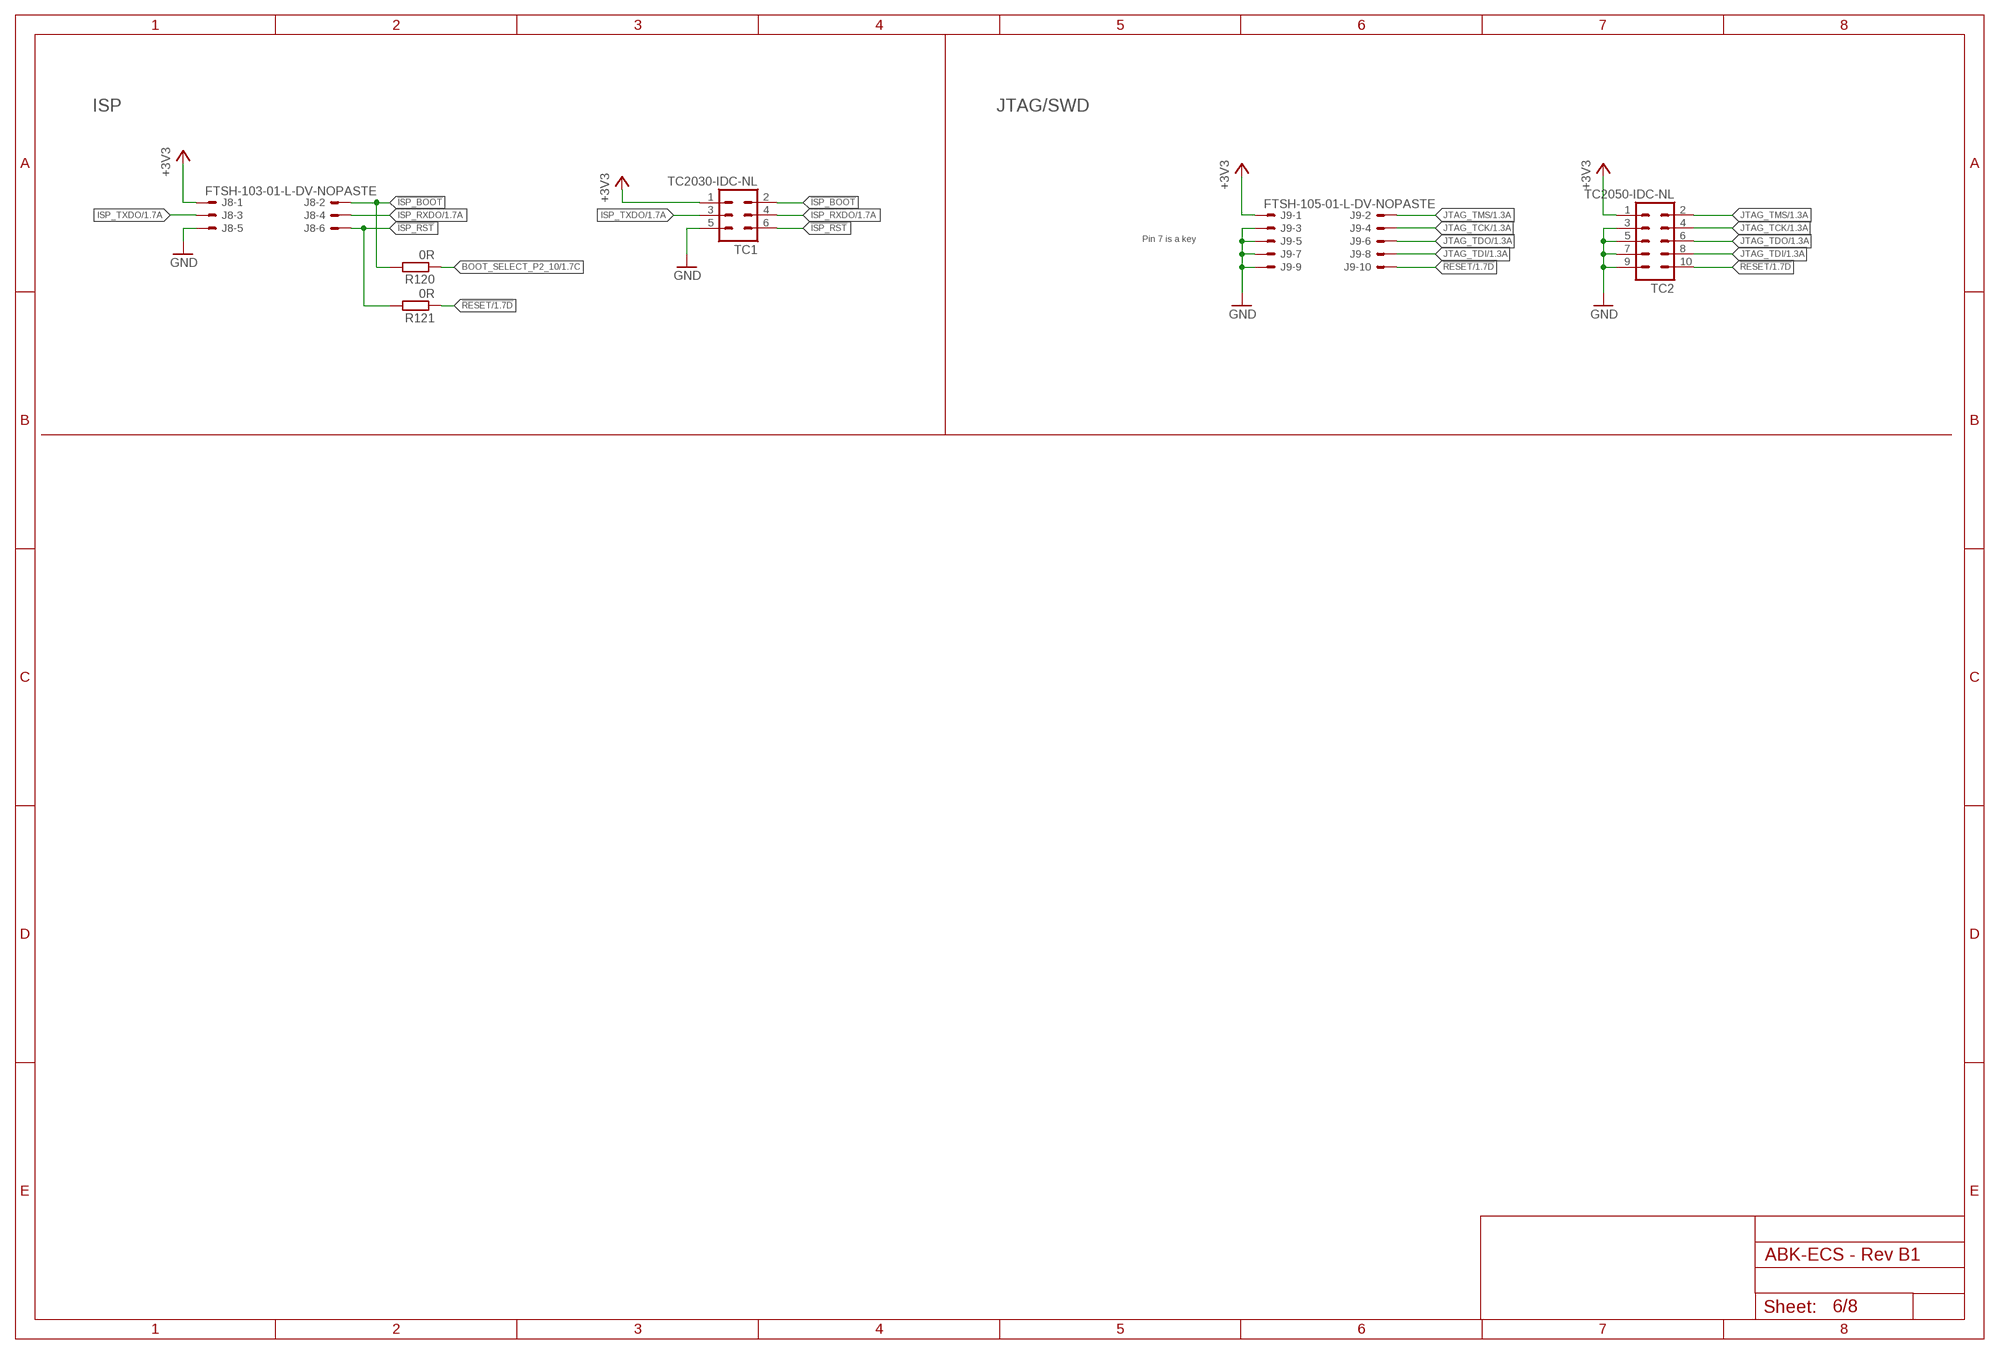
[diagram p5: schematic, sheet 6]

### Parts
J8  FTSH-103-01-L-DV-NOPASTE  [FTSH-103-01-L-DV-NOPASTE]
J9  FTSH-105-01-L-DV-NOPASTE  [FTSH-105-01-L-DV-NOPASTE]
R120  0R  R-EU_R0603  [R0603]
R121  0R  R-EU_R0603  [R0603]
TC1  TC2030-IDC-NL  [TC2030-IDC-NL]
TC2  TC2050-IDC-NL  [TC2050-IDC-NL]

### Nets
!ISP_BOOT: J8.2 R120.2 TC1.2
!ISP_RST: J8.6 R121.2 TC1.6
!RESET: J9.10 R121.1 TC2.10 ; also sheet 1
+3V3 [supply]: J8.1 J9.1 TC1.1 TC2.1 ; also sheet 1,2,3,7,8
BOOT_SELECT_P2_10 [signal]: R120.1 ; also sheet 1
GND [supply]: J8.5 J9.3 J9.5 J9.7 J9.9 TC1.5 TC2.3 TC2.5 TC2.7 TC2.9 ; also sheet 1,2,3,4,5,7,8
ISP_RXDO [signal]: J8.4 TC1.4 ; also sheet 1
ISP_TXDO [signal]: J8.3 TC1.3 ; also sheet 1
JTAG_TCK [signal]: J9.4 TC2.4 ; also sheet 1
JTAG_TDI [signal]: J9.8 TC2.8 ; also sheet 1
JTAG_TDO [signal]: J9.6 TC2.6 ; also sheet 1
JTAG_TMS [signal]: J9.2 TC2.2 ; also sheet 1

### Notes on the sheet
- ISP | JTAG/SWD
- Pin 7 is a key

## Sheet 7 of 8: Ethernet
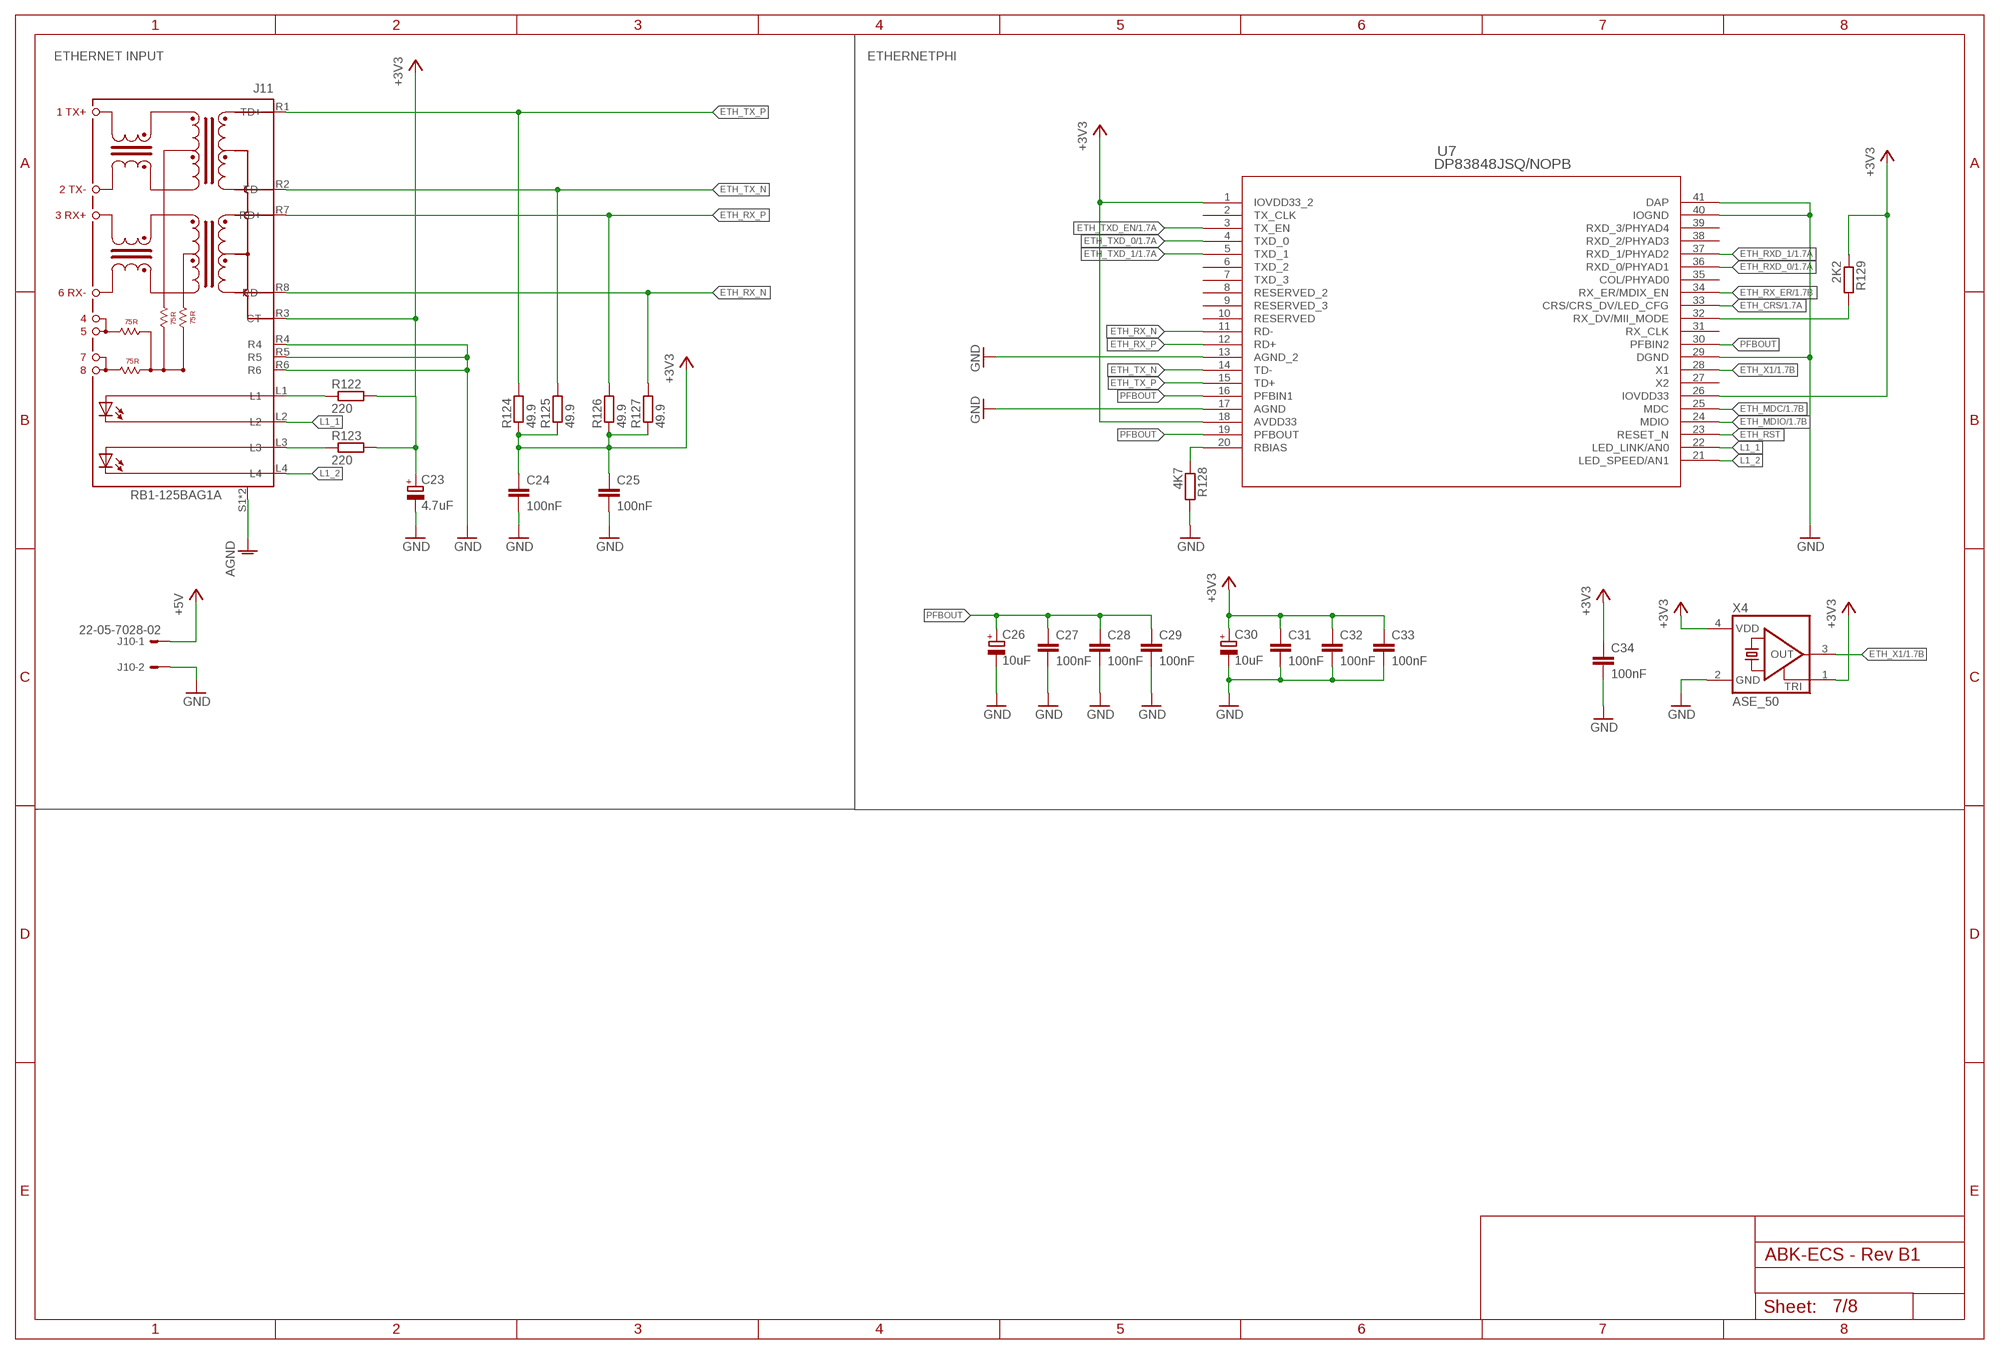
[diagram p6: schematic, sheet 7]

### Parts
C23  4.7uF  CPOL-EUCT3216  [CT3216]
C24  100nF  C-EUC0603  [C0603]
C25  100nF  C-EUC0603  [C0603]
C26  10uF  CPOL-EUCT3216  [CT3216]
C27  100nF  C-EUC0603  [C0603]
C28  100nF  C-EUC0603  [C0603]
C29  100nF  C-EUC0603  [C0603]
C30  10uF  CPOL-EUCT3216  [CT3216]
C31  100nF  C-EUC0603  [C0603]
C32  100nF  C-EUC0603  [C0603]
C33  100nF  C-EUC0603  [C0603]
C34  100nF  C-EUC0603  [C0603]
J10  22-05-7028-02  [7395-02]
J11  RB1-125BAG1A  [WIZNET_RB1-125BAG1A]
R122  220  R-EU_R0603  [R0603]
R123  220  R-EU_R0603  [R0603]
R124  49.9  R-EU_R0603  [R0603]
R125  49.9  R-EU_R0603  [R0603]
R126  49.9  R-EU_R0603  [R0603]
R127  49.9  R-EU_R0603  [R0603]
R128  4K7  R-EU_R0603  [R0603]
R129  2K2  R-EU_R0603  [R0603]
U7  DP83848JSQ/NOPB  [SQA40B]
X4  ASE_50  ASE  [ASE]

### Nets
+3V3 [supply]: C23.+ C24.1 C25.1 C30.+ C31.1 C32.1 C33.1 C34.1 J11.R3(CT) R122.2 R123.2 R124.1 R125.1 R126.1 R127.1 R129.1 U7.1(IOVDD33_2) U7.18(AVDD33) U7.26(IOVDD33) X4.1(TRI) X4.4(VDD) ; also sheet 1,2,3,6,8
+5V [supply]: J10.1 ; also sheet 2,3,4,5,8
AGND: J11.S1 J11.S2
ETH_CRS [signal]: U7.33(CRS/CRS_DV/LED_CFG) ; also sheet 1
ETH_MDC [signal]: U7.25(MDC) ; also sheet 1
ETH_MDIO [signal]: U7.24(MDIO) ; also sheet 1
ETH_RST [signal]: U7.23(RESET_N)
ETH_RX_ER [signal]: U7.34(RX_ER/MDIX_EN) ; also sheet 1
ETH_RX_N [signal]: J11.R8(RD-) R127.2 U7.11(RD-)
ETH_RX_P [signal]: J11.R7(RD+) R126.2 U7.12(RD+)
ETH_RXD_0 [signal]: U7.36(RXD_0/PHYAD1) ; also sheet 1
ETH_RXD_1 [signal]: U7.37(RXD_1/PHYAD2) ; also sheet 1
ETH_TX_N [signal]: J11.R2(TD-) R125.2 U7.14(TD-)
ETH_TX_P [signal]: J11.R1(TD+) R124.2 U7.15(TD+)
ETH_TXD_0 [signal]: U7.4(TXD_0) ; also sheet 1
ETH_TXD_1 [signal]: U7.5(TXD_1) ; also sheet 1
ETH_TXD_EN [signal]: U7.3(TX_EN) ; also sheet 1
ETH_X1 [signal]: U7.28(X1) X4.3(OUT) ; also sheet 1
GND [supply]: C23.- C24.2 C25.2 C26.- C27.2 C28.2 C29.2 C30.- C31.2 C32.2 C33.2 C34.2 J10.2 J11.R4 J11.R5 J11.R6 R128.2 U7.13(AGND_2) U7.17(AGND) U7.29(DGND) U7.40(IOGND) U7.41(DAP) X4.2(GND) ; also sheet 1,2,3,4,5,6,8
L1_1 [signal]: J11.L2 U7.22(LED_LINK/AN0)
L1_2 [signal]: J11.L4 U7.21(LED_SPEED/AN1)
MII_MODE [signal]: R129.2 U7.32(RX_DV/MII_MODE)
N$113 [signal]: J11.L1 R122.1
N$115 [signal]: J11.L3 R123.1
N$116: R128.1 U7.20(RBIAS)
PFBOUT [signal]: C26.+ C27.1 C28.1 C29.1 U7.16(PFBIN1) U7.19(PFBOUT) U7.30(PFBIN2)
Unconnected: U7.2(TX_CLK) U7.6(TXD_2) U7.7(TXD_3) U7.8(RESERVED_2) U7.9(RESERVED_3) U7.10(RESERVED) U7.27(X2) U7.31(RX_CLK) U7.35(COL/PHYAD0) U7.38(RXD_2/PHYAD3) U7.39(RXD_3/PHYAD4)

### Notes on the sheet
- ETHERNET INPUT | ETHERNETPHI

## Sheet 8 of 8
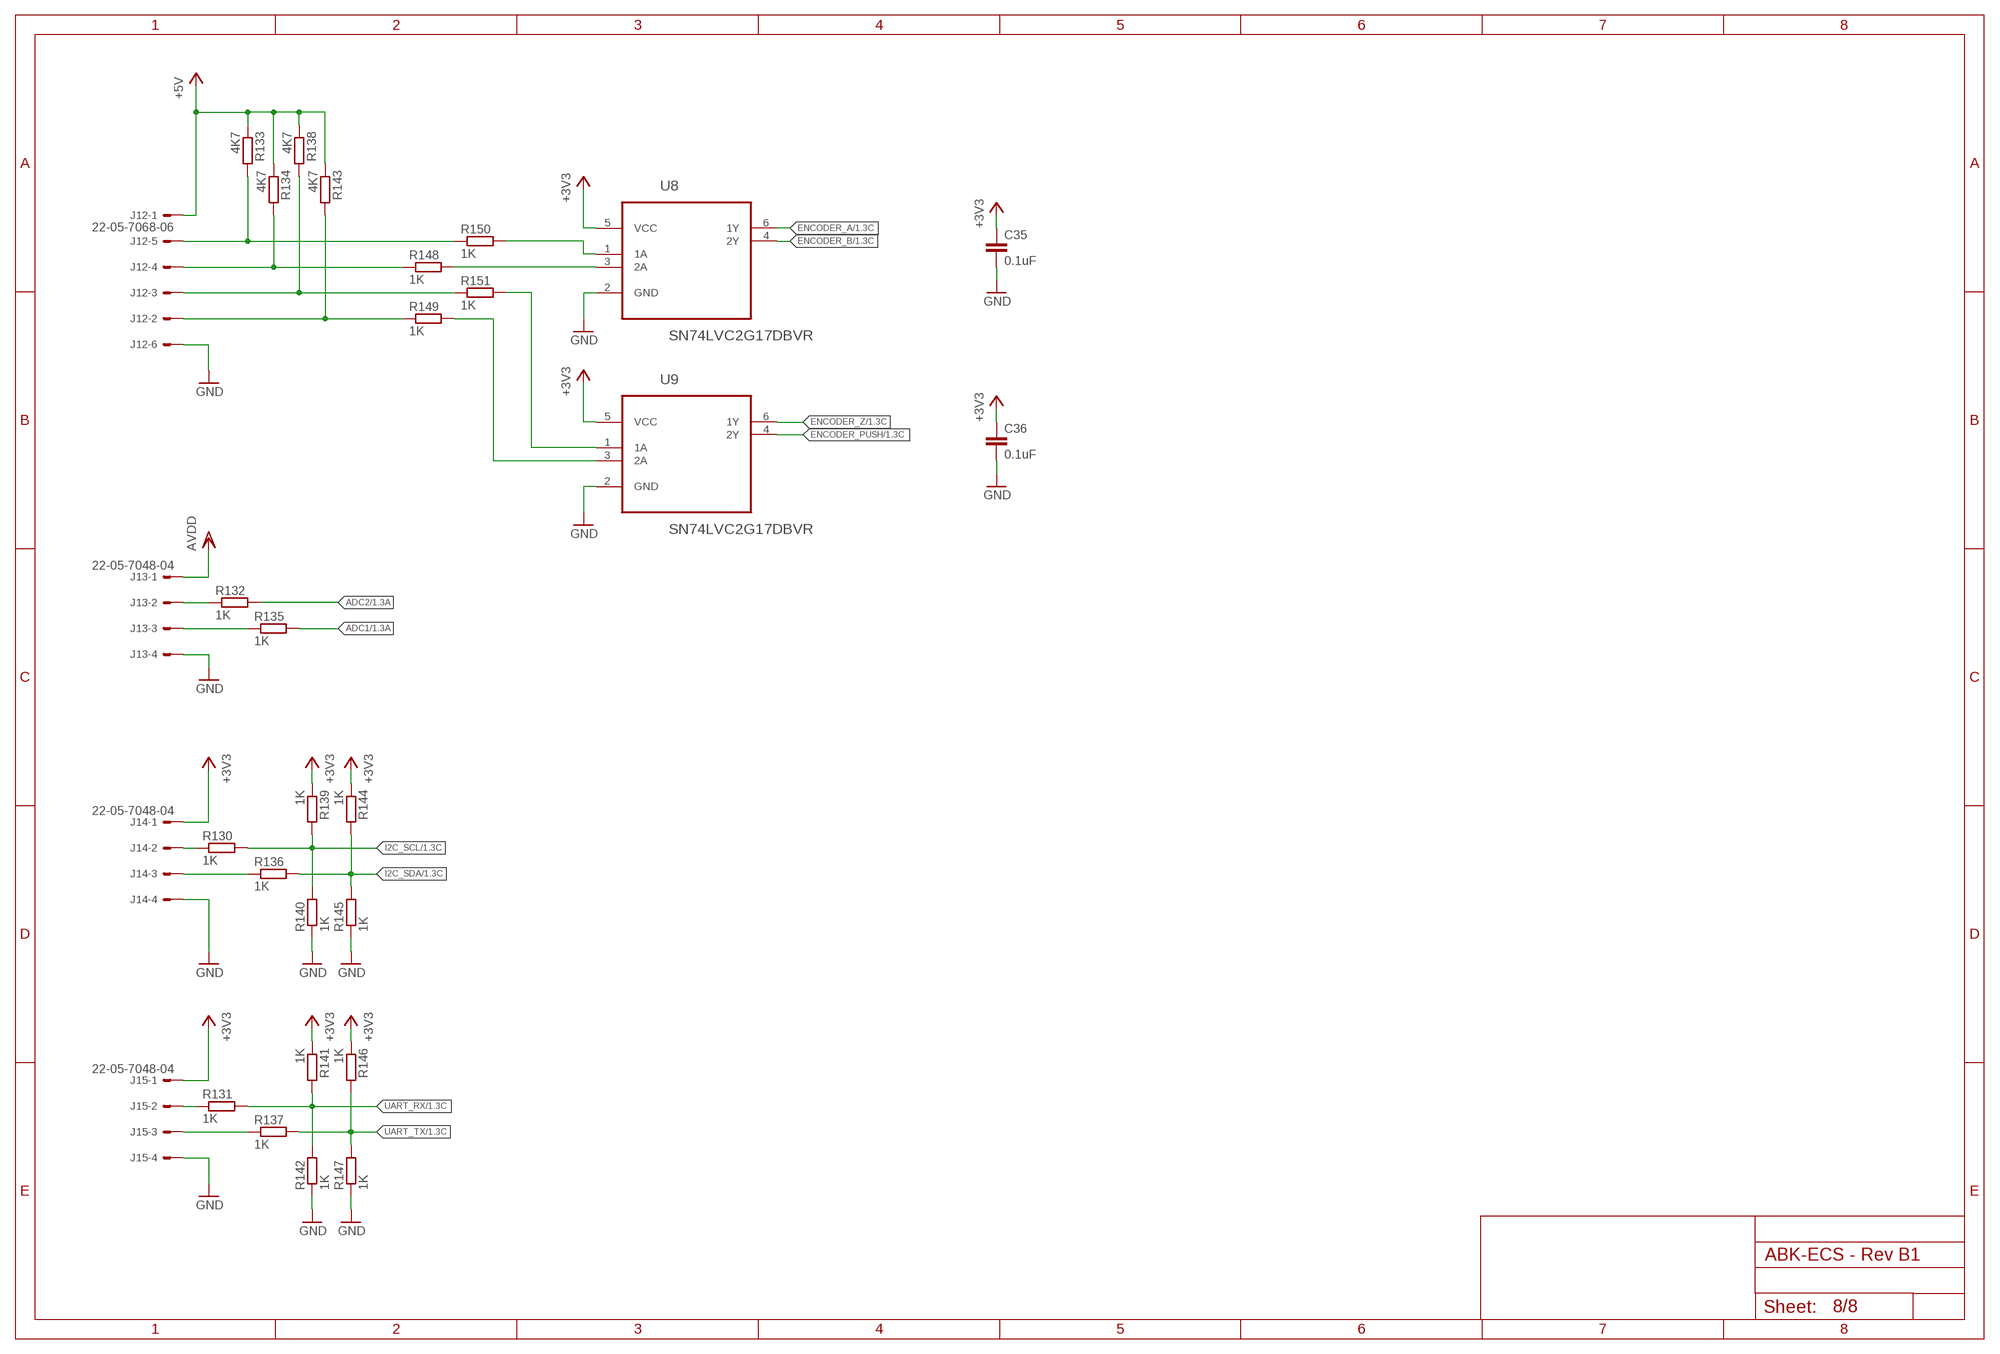
[diagram p7: schematic, sheet 8]

### Parts
C35  0.1uF  C-EUC0603  [C0603]
C36  0.1uF  C-EUC0603  [C0603]
J12  22-05-7068-06  [7395-06]
J13  22-05-7048-04  [7395-04]
J14  22-05-7048-04  [7395-04]
J15  22-05-7048-04  [7395-04]
R130  1K  R-EU_R0603  [R0603]
R131  1K  R-EU_R0603  [R0603]
R132  1K  R-EU_R0603  [R0603]
R133  4K7  R-EU_R0603  [R0603]
R134  4K7  R-EU_R0603  [R0603]
R135  1K  R-EU_R0603  [R0603]
R136  1K  R-EU_R0603  [R0603]
R137  1K  R-EU_R0603  [R0603]
R138  4K7  R-EU_R0603  [R0603]
R139  1K  R-EU_R0603  [R0603]
R140  1K  R-EU_R0603  [R0603]
R141  1K  R-EU_R0603  [R0603]
R142  1K  R-EU_R0603  [R0603]
R143  4K7  R-EU_R0603  [R0603]
R144  1K  R-EU_R0603  [R0603]
R145  1K  R-EU_R0603  [R0603]
R146  1K  R-EU_R0603  [R0603]
R147  1K  R-EU_R0603  [R0603]
R148  1K  R-EU_R0603  [R0603]
R149  1K  R-EU_R0603  [R0603]
R150  1K  R-EU_R0603  [R0603]
R151  1K  R-EU_R0603  [R0603]
U8  SN74LVC2G17DBVR  [SOT95P280X145-6N]
U9  SN74LVC2G17DBVR  [SOT95P280X145-6N]

### Nets
+3V3 [supply]: C35.1 C36.1 J14.1 J15.1 R139.1 R141.1 R144.1 R146.1 U8.5(VCC) U9.5(VCC) ; also sheet 1,2,3,6,7
+5V [supply]: J12.1 R133.1 R134.1 R138.1 R143.1 ; also sheet 2,3,4,5,7
ADC1: R135.2 ; also sheet 1
ADC2: R132.2 ; also sheet 1
AVDD: J13.1 ; also sheet 1
ENCODER_A: U8.6(1Y) ; also sheet 1
ENCODER_B: U8.4(2Y) ; also sheet 1
ENCODER_PUSH: U9.4(2Y) ; also sheet 1
ENCODER_Z: U9.6(1Y) ; also sheet 1
GND [supply]: C35.2 C36.2 J12.6 J13.4 J14.4 J15.4 R140.1 R142.1 R145.1 R147.1 U8.2(GND) U9.2(GND) ; also sheet 1,2,3,4,5,6,7
I2C_SCL: R130.2 R139.2 R140.2 ; also sheet 1
I2C_SDA: R136.2 R144.2 R145.2 ; also sheet 1
N$117: J12.5 R133.2 R150.1
N$118: J12.4 R134.2 R148.1
N$119: J12.3 R138.2 R151.1
N$120: R149.2 U9.3(2A)
N$121: R148.2 U8.3(2A)
N$122: R150.2 U8.1(1A)
N$123: R151.2 U9.1(1A)
N$124: J12.2 R143.2 R149.1
N$125: J13.2 R132.1
N$126: J13.3 R135.1
N$127: J14.2 R130.1
N$128: J14.3 R136.1
N$129: J15.2 R131.1
N$130: J15.3 R137.1
UART_RX: R131.2 R141.2 R142.2 ; also sheet 1
UART_TX: R137.2 R146.2 R147.2 ; also sheet 1

## Library data of the parts
C1 C26 C30 = rcl:CPOL-EU: POLARIZED CAPACITOR, European symbol; MPN: F931A106MAA; OC_NEWARK: 58R3260
C2-C4 C6-C9 C11 C12 C21 C22 C35 C36 = rcl:C-EU: CAPACITOR, European symbol; MPN: MC0603B104K160CT; OC_NEWARK: 06R4923
C5 C10 = rcl:C-EU: CAPACITOR, European symbol; MPN: GRM1885C1H180JA01D; OC_NEWARK: 14T3328
C13 C14 C17 C18 = rcl:C-EU: CAPACITOR, European symbol; MPN: GRT188R61H225KE13D; OC_NEWARK: 01AC8938
C15 C16 = rcl:C-EU: CAPACITOR, European symbol; MPN: GRM188R71H102KA01D; OC_NEWARK: 19X1713
C19 C20 = rcl:C-EU: CAPACITOR, European symbol; MF: KEMET; MPN: C0805C226M9PACTU; OC_NEWARK: 70K9142
C23 = rcl:CPOL-EU: POLARIZED CAPACITOR, European symbol; MPN: F931A475MAA; OC_NEWARK: 58R3271
C24 C25 C27-C29 C31-C34 = rcl:C-EU: CAPACITOR, European symbol; MPN: MC0603B104K250CT; OC_NEWARK: 06R4925
CC1 = cc-by-sa:CC-BY-NC-SA; OC_NEWARK: unknown
D1 D2 = diode:MBRS140: Redresseur Schottky, 40 V, 1 A, Une, DO-214AA, 2 Broche(s), 600 mV; MF: ON SEMICONDUCTOR; MPN: MBRS140T3G; OC_NEWARK: 83H7272
D3 = diode:STPS3L40?; MP: STMICROELECTRONICS; MPN: STPS3L40UF; OC_FARNELL: 2341599; OC_NEWARK: 06X0873
D4-D12 = diode:1N4148WS; MPN: 1N4148WS; OC_NEWARK: 31Y5518
F1 = fuse2:1812L; MPN: 3557; OC_NEWARK: 22M2711
J1 = con-multicomp:USB-B-S-RA: MULTICOMP USB-B-S-RA USB Connector, USB Type B, USB 2.0, Receptacle, 4 Positions, Through Hole Mount, Right Angle; MPN: USB-B-S-RA; OC_NEWARK: 14N8154
J2 = con-phoenix-508:MSTBA2: PHOENIX; MF: FARNELL; MPN: 1757242; OC_FARNELL: 3705171; OC_NEWARK: 71C4161
J3-J6 = con-molex:22-?-06: CONNECTOR wire to board 2.54 mm (.1 inch) pitch header; OC_FARNELL: unknown; OC_NEWARK: unknown
J7 J10 = con-molex:22-?-02: CONNECTOR wire to board 2.54 mm (.1 inch) pitch header; MPN: 22-05-7028; OC_FARNELL: 9731601; OC_NEWARK: 25M1728
J8 = con-samtec:FTSH-103-01-L-DV
J9 = con-samtec:FTSH-105-01-L-DV
J11 = con-wiznet:RB1-125BAG1A: Accessory RJ-45 With Transformer Connector - UDE; OC_NEWARK: unknown
J12 = con-molex:22-?-06: CONNECTOR wire to board 2.54 mm (.1 inch) pitch header; MF: MOLEX; MPN: 22-05-7058; OC_FARNELL: unknown; OC_NEWARK: 55H9619
J13-J15 = con-molex:22-?-04: CONNECTOR wire to board 2.54 mm (.1 inch) pitch header; OC_FARNELL: unknown; OC_NEWARK: unknown
JP1-JP4 = SparkFun:FIDUCIAL: Fiducial Alignment Points Various fiducial points for machine vision alignment.; OC_NEWARK: unknown
L1 = coilcraft:0603PS; OC_NEWARK: unknown
L2 = Wurth-POWER_MAGNETICS-rev16f:WE-PD2: SMD Power Inductor Characteristics Open size Saturation currents up to 14 A Low tolerances at high inductance values Operating temperature: –40 °C to +125 °C Applications Integrated DC/DC-converter Switching regulators with low operating voltages (Graphic cards, embedded PC-Cards, Mainboards) Optimal attenuation in MHz frequency range Details see: http://katalog.we-online.de/en/pbs/WE-PD2 Updated by Dan Xu 2014-07-08 2014 (C) Wurth Elektronik; MPN: 744774115; OC_NEWARK: 08P2818
L3 = Wurth-POWER_MAGNETICS-rev16f:WE-PD2: SMD Power Inductor Characteristics Open size Saturation currents up to 14 A Low tolerances at high inductance values Operating temperature: –40 °C to +125 °C Applications Integrated DC/DC-converter Switching regulators with low operating voltages (Graphic cards, embedded PC-Cards, Mainboards) Optimal attenuation in MHz frequency range Details see: http://katalog.we-online.de/en/pbs/WE-PD2 Updated by Dan Xu 2014-07-08 2014 (C) Wurth Elektronik; MPN: 74477410; OC_NEWARK: 08P2817
LED1-LED3 LED5 LED8-LED24 = led:LED: LED OSRAM: - CHIPLED LG R971, LG N971, LY N971, LG Q971, LY Q971, LO R971, LY R971 LH N974, LH R974 LS Q976, LO Q976, LY Q976 LO Q996 - Hyper CHIPLED LW Q18S LB Q993, LB Q99A, LB R99A - SideLED LS A670, LO A670, LY A670, LG A670, LP A670 LB A673, LV A673, LT A673, LW A673 LH A674 LY A675 LS A676, LA A676, LO A676, LY A676, LW A676 LS A679, LY A679, LG A679 - Hyper Micro SIDELED® LS Y876, LA Y876, LO Y876, LY Y876 LT Y87S - SmartLED LW L88C, LW L88S LB L89C, LB L89S, LG L890 LS L89K, LO L89K, LY L89K LS L896, LA L896, LO L896, LY L896 - TOPLED LS T670, LO T670, LY T670, LG T670, LP T670 LSG T670, LSP T670, LSY T670, LOP T670, LYG T670 LG T671, LOG T671, LSG T671 LB T673, LV T673, LT T673, LW T673 LH T674 LS T676, LA T676, LO T676, LY T676, LB T676, LH T676, LSB T676, LW T676 LB T67C, LV T67C, LT T67C, LS T67K, LO T67K, LY T67K, LW E67C LS E67B, LA E67B, LO E67B, LY E67B, LB E67C, LV E67C, LT E67C LW T67C LS T679, LY T679, LG T679 LS T770, LO T770, LY T770, LG T770, LP T770 LB T773, LV T773, LT T773, LW T773 LH T774 LS E675, LA E675, LY E675, LS T675 LS T776, LA T776, LO T776, LY T776, LB T776 LHGB T686 LT T68C, LB T68C - Hyper Mini TOPLED® LB M676 - Mini TOPLED Santana® LG M470 LS M47K, LO M47K, LY M47K Source: http://www.osram.convergy.de LUXEON: - LUMILED® LXK2-PW12-R00, LXK2-PW12-S00, LXK2-PW14-U00, LXK2-PW14-V00 LXK2-PM12-R00, LXK2-PM12-S00, LXK2-PM14-U00 LXK2-PE12-Q00, LXK2-PE12-R00, LXK2-PE12-S00, LXK2-PE14-T00, LXK2-PE14-U00 LXK2-PB12-K00, LXK2-PB12-L00, LXK2-PB12-M00, LXK2-PB14-N00, LXK2-PB14-P00, LXK2-PB14-Q00 LXK2-PR12-L00, LXK2-PR12-M00, LXK2-PR14-Q00, LXK2-PR14-R00 LXK2-PD12-Q00, LXK2-PD12-R00, LXK2-PD12-S00 LXK2-PH12-R00, LXK2-PH12-S00 LXK2-PL12-P00, LXK2-PL12-Q00, LXK2-PL12-R00 Source: www.luxeon.com KINGBRIGHT: KA-3528ASYC Source: www.kingbright.com; MPN: OVS-0603; OC_NEWARK: 15R2205
LED4 = led:LED: LED OSRAM: - CHIPLED LG R971, LG N971, LY N971, LG Q971, LY Q971, LO R971, LY R971 LH N974, LH R974 LS Q976, LO Q976, LY Q976 LO Q996 - Hyper CHIPLED LW Q18S LB Q993, LB Q99A, LB R99A - SideLED LS A670, LO A670, LY A670, LG A670, LP A670 LB A673, LV A673, LT A673, LW A673 LH A674 LY A675 LS A676, LA A676, LO A676, LY A676, LW A676 LS A679, LY A679, LG A679 - Hyper Micro SIDELED® LS Y876, LA Y876, LO Y876, LY Y876 LT Y87S - SmartLED LW L88C, LW L88S LB L89C, LB L89S, LG L890 LS L89K, LO L89K, LY L89K LS L896, LA L896, LO L896, LY L896 - TOPLED LS T670, LO T670, LY T670, LG T670, LP T670 LSG T670, LSP T670, LSY T670, LOP T670, LYG T670 LG T671, LOG T671, LSG T671 LB T673, LV T673, LT T673, LW T673 LH T674 LS T676, LA T676, LO T676, LY T676, LB T676, LH T676, LSB T676, LW T676 LB T67C, LV T67C, LT T67C, LS T67K, LO T67K, LY T67K, LW E67C LS E67B, LA E67B, LO E67B, LY E67B, LB E67C, LV E67C, LT E67C LW T67C LS T679, LY T679, LG T679 LS T770, LO T770, LY T770, LG T770, LP T770 LB T773, LV T773, LT T773, LW T773 LH T774 LS E675, LA E675, LY E675, LS T675 LS T776, LA T776, LO T776, LY T776, LB T776 LHGB T686 LT T68C, LB T68C - Hyper Mini TOPLED® LB M676 - Mini TOPLED Santana® LG M470 LS M47K, LO M47K, LY M47K Source: http://www.osram.convergy.de LUXEON: - LUMILED® LXK2-PW12-R00, LXK2-PW12-S00, LXK2-PW14-U00, LXK2-PW14-V00 LXK2-PM12-R00, LXK2-PM12-S00, LXK2-PM14-U00 LXK2-PE12-Q00, LXK2-PE12-R00, LXK2-PE12-S00, LXK2-PE14-T00, LXK2-PE14-U00 LXK2-PB12-K00, LXK2-PB12-L00, LXK2-PB12-M00, LXK2-PB14-N00, LXK2-PB14-P00, LXK2-PB14-Q00 LXK2-PR12-L00, LXK2-PR12-M00, LXK2-PR14-Q00, LXK2-PR14-R00 LXK2-PD12-Q00, LXK2-PD12-R00, LXK2-PD12-S00 LXK2-PH12-R00, LXK2-PH12-S00 LXK2-PL12-P00, LXK2-PL12-Q00, LXK2-PL12-R00 Source: www.luxeon.com KINGBRIGHT: KA-3528ASYC Source: www.kingbright.com; MPN: OVS-0608; OC_NEWARK: 15R2208
LED6 LED7 = led:LED: LED OSRAM: - CHIPLED LG R971, LG N971, LY N971, LG Q971, LY Q971, LO R971, LY R971 LH N974, LH R974 LS Q976, LO Q976, LY Q976 LO Q996 - Hyper CHIPLED LW Q18S LB Q993, LB Q99A, LB R99A - SideLED LS A670, LO A670, LY A670, LG A670, LP A670 LB A673, LV A673, LT A673, LW A673 LH A674 LY A675 LS A676, LA A676, LO A676, LY A676, LW A676 LS A679, LY A679, LG A679 - Hyper Micro SIDELED® LS Y876, LA Y876, LO Y876, LY Y876 LT Y87S - SmartLED LW L88C, LW L88S LB L89C, LB L89S, LG L890 LS L89K, LO L89K, LY L89K LS L896, LA L896, LO L896, LY L896 - TOPLED LS T670, LO T670, LY T670, LG T670, LP T670 LSG T670, LSP T670, LSY T670, LOP T670, LYG T670 LG T671, LOG T671, LSG T671 LB T673, LV T673, LT T673, LW T673 LH T674 LS T676, LA T676, LO T676, LY T676, LB T676, LH T676, LSB T676, LW T676 LB T67C, LV T67C, LT T67C, LS T67K, LO T67K, LY T67K, LW E67C LS E67B, LA E67B, LO E67B, LY E67B, LB E67C, LV E67C, LT E67C LW T67C LS T679, LY T679, LG T679 LS T770, LO T770, LY T770, LG T770, LP T770 LB T773, LV T773, LT T773, LW T773 LH T774 LS E675, LA E675, LY E675, LS T675 LS T776, LA T776, LO T776, LY T776, LB T776 LHGB T686 LT T68C, LB T68C - Hyper Mini TOPLED® LB M676 - Mini TOPLED Santana® LG M470 LS M47K, LO M47K, LY M47K Source: http://www.osram.convergy.de LUXEON: - LUMILED® LXK2-PW12-R00, LXK2-PW12-S00, LXK2-PW14-U00, LXK2-PW14-V00 LXK2-PM12-R00, LXK2-PM12-S00, LXK2-PM14-U00 LXK2-PE12-Q00, LXK2-PE12-R00, LXK2-PE12-S00, LXK2-PE14-T00, LXK2-PE14-U00 LXK2-PB12-K00, LXK2-PB12-L00, LXK2-PB12-M00, LXK2-PB14-N00, LXK2-PB14-P00, LXK2-PB14-Q00 LXK2-PR12-L00, LXK2-PR12-M00, LXK2-PR14-Q00, LXK2-PR14-R00 LXK2-PD12-Q00, LXK2-PD12-R00, LXK2-PD12-S00 LXK2-PH12-R00, LXK2-PH12-S00 LXK2-PL12-P00, LXK2-PL12-Q00, LXK2-PL12-R00 Source: www.luxeon.com KINGBRIGHT: KA-3528ASYC Source: www.kingbright.com; MPN: OVS-0603; OC_FARNELL: 1716771; OC_NEWARK: 15R2205
MP1-MP4 = holes:MOUNT-PAD: MOUNTING HOLE with drill center marker; OC_NEWARK: unknown
OK1-OK4 = optocoupler:TLP283-4: TOSHIBA PHOTOCOUPLER GaAs IRED & PHOTO-TRANSISTOR Source: http://www.semicon.toshiba.co.jp/td/en/Opto/Photocoupler/en_20050928_TLP283_datasheet.pdf; MF: VISHAY/TELEFUNKEN; MPN: TCMT4100; OC_FARNELL: unknown; OC_NEWARK: 06H1639
R1-R4 R20 R21 R36-R39 R48-R51 R77-R80 R108-R111 = rcl:R-EU_: RESISTOR, European symbol; MPN: RC0603FR-074K7L; OC_NEWARK: 68R0092
R5 R11 R16 R17 R52-R60 R73-R76 R104-R107 = rcl:R-EU_: RESISTOR, European symbol; MPN: RC0603FR-071K5L; OC_NEWARK: 68R0045
R6 R7 R61-R64 R89 R92-R95 = rcl:R-EU_: RESISTOR, European symbol
R8 R13 R14 = rcl:R-EU_: RESISTOR, European symbol; MPN: RC0603FR-070RL; OC_NEWARK: 50Y7761
R9 R10 = rcl:R-EU_: RESISTOR, European symbol; MPN: RC0603FR-0733RL; OC_NEWARK: 68R0085
R12 R15 R65-R68 R90 R96-R99 = rcl:R-EU_: RESISTOR, European symbol; MPN: RC0603FR-0710KL; OC_NEWARK: 68R0049
R18 R19 R24 = rcl:R-EU_: RESISTOR, European symbol; MPN: MCMR06X3162FTL; OC_FARNELL: 2073391; OC_NEWARK: 86T3613
R22 = rcl:R-EU_: RESISTOR, European symbol; MPN: MC0063W0603152K3; OC_FARNELL: 2073391; OC_NEWARK: 26M0962
R23 R25 = rcl:R-EU_: RESISTOR, European symbol; MPN: RC0603FR-0710KL; OC_FARNELL: 2073391; OC_NEWARK: 68R0049
R26 R27 = rcl:R-EU_: RESISTOR, European symbol; MPN: RC0603FR-071K5L; OC_FARNELL: 2073391; OC_NEWARK: 68R0045
R28-R35 R40-R47 R69-R72 R100-R103 = rcl:R-EU_: RESISTOR, European symbol; MPN: RC0603FR-071KL; OC_NEWARK: 68R0042
R81-R84 R91 R112-R115 = rcl:R-EU_: RESISTOR, European symbol; MPN: RC0603FR-13100RL; OC_NEWARK: 68R0131
R85-R88 R116-R119 = rcl:R-EU_: RESISTOR, European symbol; MPN: RC0603FR-07330RL; OC_NEWARK: 98K7391
R120 R121 = rcl:R-EU_: RESISTOR, European symbol; MPN: MCMR06X000 PTL; OC_NEWARK: 86T3500
R122 R123 = rcl:R-EU_: RESISTOR, European symbol; MPN: MCMR06X2200FTL; OC_NEWARK: 86T3577
R124-R127 = rcl:R-EU_: RESISTOR, European symbol; MPN: MCMR06X49R9FTL; OC_NEWARK: 86T3659
R128 = rcl:R-EU_: RESISTOR, European symbol; MPN: MCMR06X4701FTL; OC_NEWARK: 86T3649
R129 = rcl:R-EU_: RESISTOR, European symbol; MPN: MCMR06X2201FTL; OC_NEWARK: 86T3578
R130-R132 R135-R137 R139-R142 R144-R151 = rcl:R-EU_: RESISTOR, European symbol; MPN: MCMR06X1001FTL; OC_NEWARK: 86T3505
R133 R134 R138 R143 = rcl:R-EU_: RESISTOR, European symbol; MPN: MCMR06X2701FTL; OC_NEWARK: 86T3598
SJ1-SJ5 = SparkFun-Passives:SJ: Solder Jumper Standard SMD solder jumper. Used to automate production. Two varients : Normally Open and Normally Closed are the same, but have different paste layers. NC will have a large amount of paste and should jumper during reflow.; OC_NEWARK: unknown
SW1 SW2 = Switch_SMT:B3FS: Surface-mounting Switches Ideal for High-density Mounting; MPN: B3FS-1010; OC_NEWARK: 36M3638
T1 = transistor:MMBT2907ALT3
T2 = exmachina:EXMACHINA-LOGO; OC_NEWARK: unknown
T3-T6 T11 T13-T16 = International_Rectifier_By_element14_Batch_1:IRLML5103TRPBF; MF: INTERNATIONAL RECTIFIER(IR); MPN: IRLML5103TRPBF; OC_NEWARK: 63J7612
T7-T10 T12 T17-T20 = transistor:MMBT2222AL: General Purpose Transistors; MF: ON SEMICONDUCTOR; MPN: MMBT2222ALT1G; OC_NEWARK: 84K8795
TC1 = TagConnect:TC2030-IDC: Tag-Connect In Circuit Programming & Debug Cable 6 Pin http://www.tag-connect.com
TC2 = TagConnect:TC2050-IDC: Tag-Connect In Circuit Programming & Debug Cable 10 Pin http://www.tag-connect.com
U1 = atmel:AT24C512C-SSHM-B: SERIAL EEPROM IC Memory Size:512Kbit,8-SOIC; MPN: AT24C512C-SSHM-B; OC_FARNELL: 1971995; OC_NEWARK: 68T4128; PACKAGE: 8SOIC; SUPPLIER: ATMEL
U2 = NXP:LPC1768FBD100; COPYRIGHT: Copyright C 2015 Accelerated Designs. All rights reserved; MANUFACTURER_PART_NUMBER: lpc1768fbd100; MPN: LPC1768FBD100; OC_NEWARK: 15R1840; VENDOR: NXP
U3 U4 = lineartechnology:LT3686HDDPBF: 37V/1.2A Step-DownRegulator in 3mm × 3mm DFN; MPN: LT3686HDD#PBF; OC_FARNELL: 2294943; OC_NEWARK: 78R8986; PACKAGE: DFN-10; SUPPLIER: Linear Technology
U5 U6 = ti:CD4050BD: CMOS Hex Buffer/Converters; MPN: CD4050BD; OC_FARNELL: 1740857; OC_NEWARK: 50R5062; PACKAGE: 16-SOIC; SUPPLIER: Texas Instruments
U7 = textas:DP83848JSQ/NOPB; COPYRIGHT: Copyright C 2015 Accelerated Designs. All rights reserved; MANUFACTURER_PART_NUMBER: dp83848jsqnopb; MPN: DP83848JSQ/NOPB; OC_NEWARK: 96W2841; VENDOR: National Semiconductor
U8 U9 = ti:SN74LVC2G17DBVR: DUAL SCHMITT-TRIGGER BUFFER; MPN: SN74LVC2G17DBVR; OC_FARNELL: 1470776; OC_NEWARK: 76C4207; PACKAGE: SOT-23-6; SUPPLIER: Texas Instruments
X1 = crystal:FC-135: 32.768kHz ±20ppm Crystal 12.5pF 70 kOhm -40°C ~ 85°C Surface Mount 2-SMD; MPN: Q13FC13500004; OC_NEWARK: 31M4970
X2 = crystal:ASE: 3.3Vdc CMOS SMD CRYSTAL CLOCK OSCILLATOR SOurce: www.abracon.com; MPN: ASE-12.000MHZ-LC-T; OC_FARNELL: unknown; OC_NEWARK: 40Y2118
X3 = keystone:3000; MF: KEYSTONE ELECTR; MPN: 3000; OC_NEWARK: 66F5622
X4 = crystal:ASE: 3.3Vdc CMOS SMD CRYSTAL CLOCK OSCILLATOR SOurce: www.abracon.com; MPN: ASE-50.000MHZ-LC-T; OC_FARNELL: unknown; OC_NEWARK: 84R2105

## Net classes
1 signal: width 0.178 mm, drill 0.35 mm
2 supply: width 0.008 mm, drill 0.5 mm